# EAGLE design Calciatore Rev.2 UP (EAGLE 7.2.0)

## Sheet 1 of 3
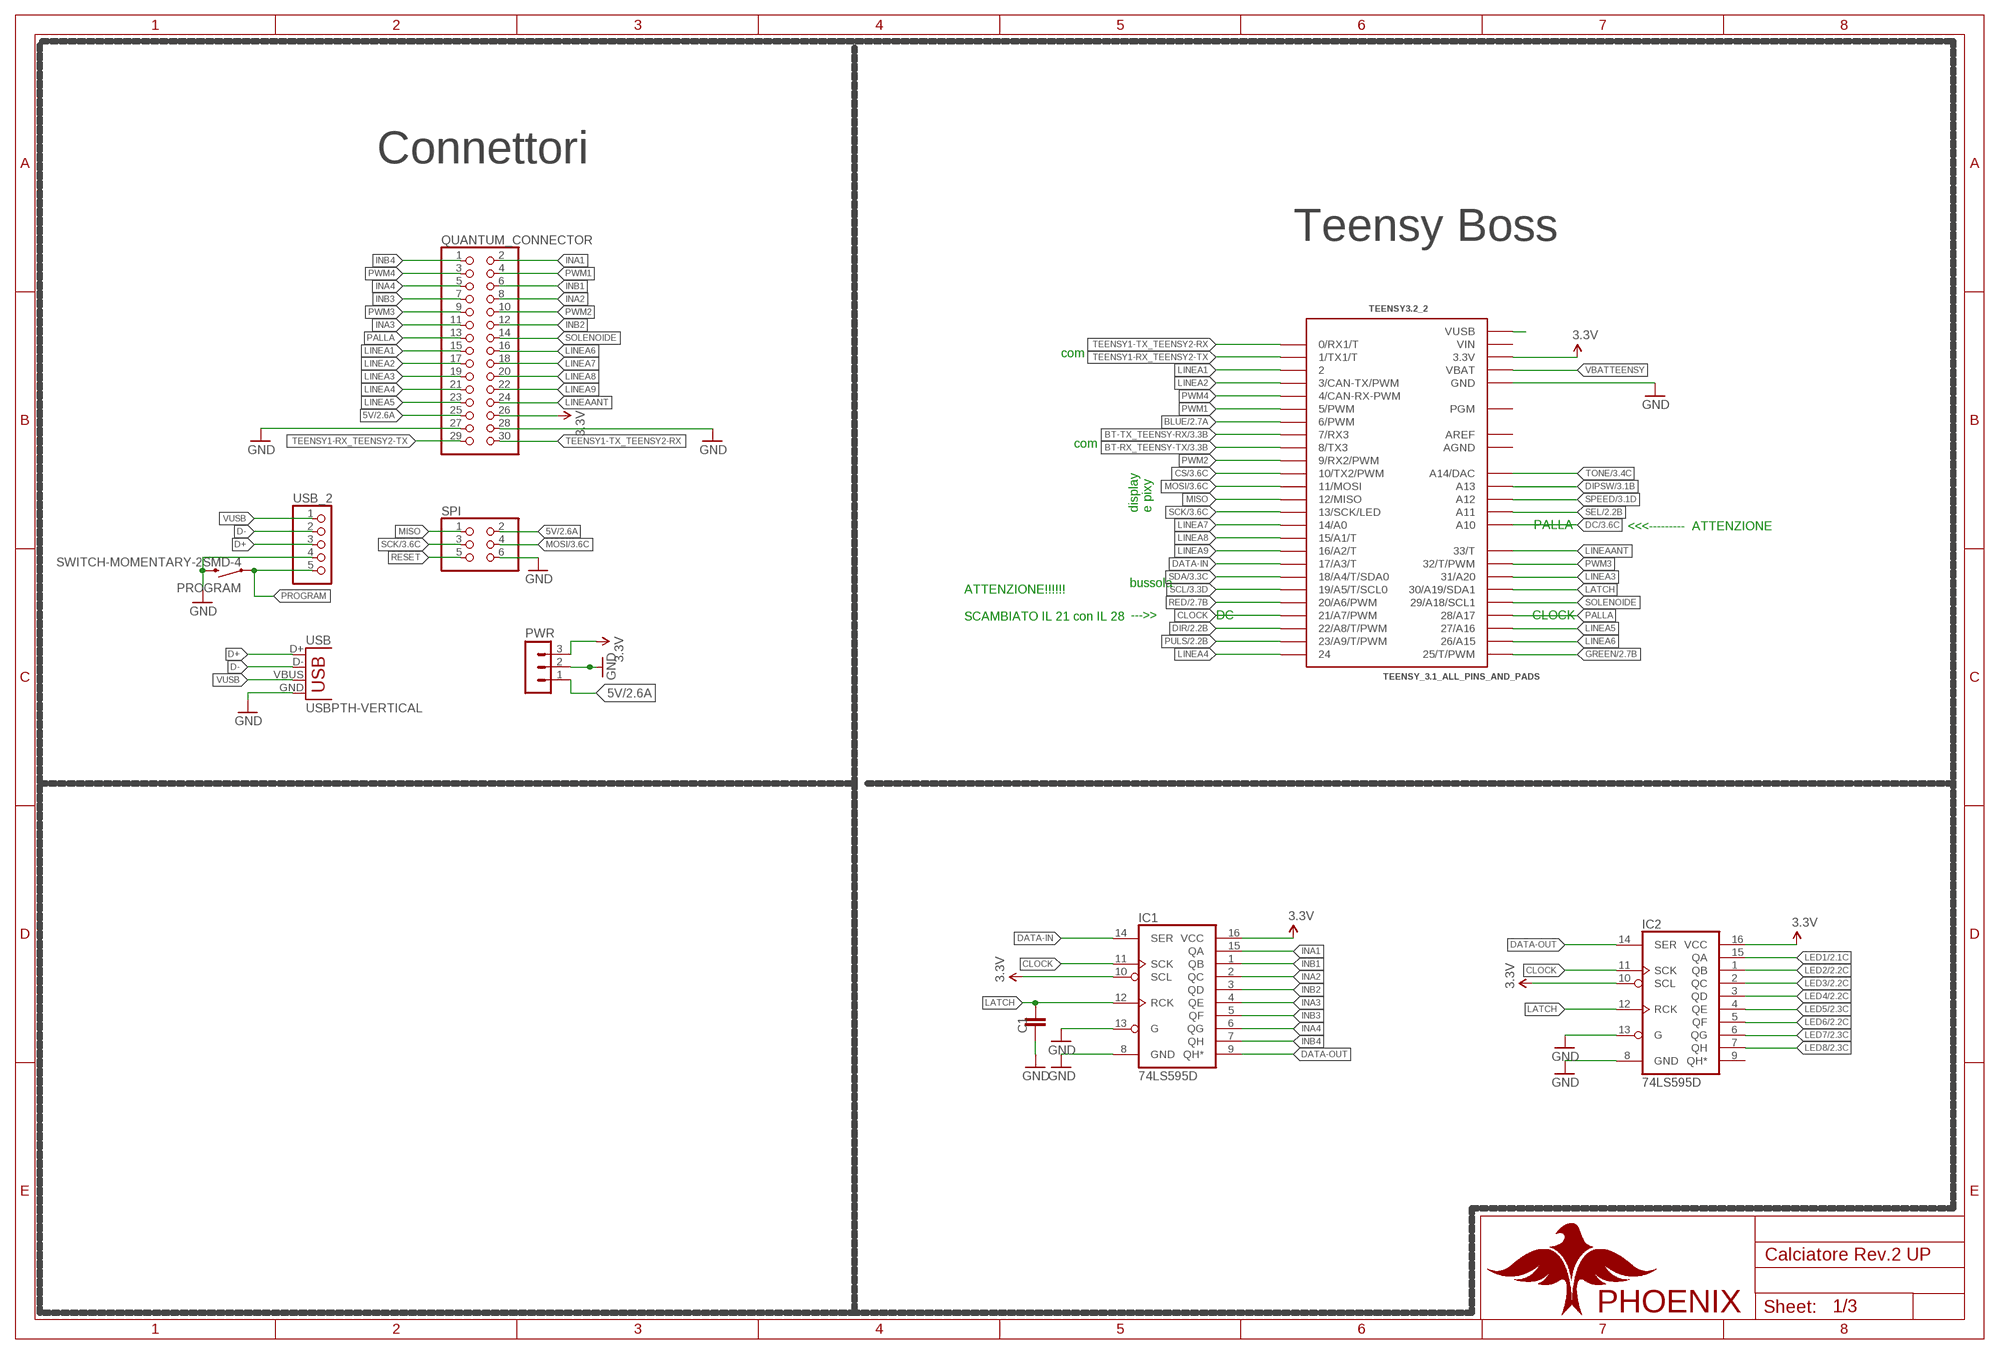
[diagram p0: schematic, sheet 1]

### Parts
C1  C-EUC1206  [C1206]
IC1  74LS595D  [SO16]
IC2  74LS595D  [SO16]
PROGRAM  SWITCH-MOMENTARY-2SMD-4  [TACTILE_SWITCH_TALL]
PWR  MA03-1  [MA03-1]
QUANTUM_CONNECTOR  PINHD-2X15  [2X15]
SPI  PINHD-2X3  [2X03]
TEENSY3.2_2  TEENSY_3.1_ALL_PINS_AND_PADS  [TEENSY3_ALL_PINS_&_PADS]
USB  USBPTH-VERTICAL  [USB-B-PTH-VERTICAL]
USB_2  PINHD-1X5  [1X05]

### Nets
3.3V [power]: IC1.10(SCL) IC1.16(VCC) IC2.10(SCL) IC2.16(VCC) PWR.3 QUANTUM_CONNECTOR.26 TEENSY3.2_2.3.3V TEENSY3.2_2.3.3V1(3.3V) TEENSY3.2_2.3.3V2(3.3V) ; also sheet 2,3
5V [power]: PWR.1 QUANTUM_CONNECTOR.25 SPI.2 ; also sheet 2
BLUE: TEENSY3.2_2.6(6/PWM) ; also sheet 2
BT-RX_TEENSY-TX: TEENSY3.2_2.8(8/TX3) ; also sheet 3
BT-TX_TEENSY-RX: TEENSY3.2_2.7(7/RX3) ; also sheet 3
CLOCK: IC1.11(SCK) IC2.11(SCK) TEENSY3.2_2.21/A7(21/A7/PWM)
CS: TEENSY3.2_2.10(10/TX2/PWM) ; also sheet 3
D+: USB.D+ USB_2.3
D-: USB.D- USB_2.2
DATA-IN: IC1.14(SER) TEENSY3.2_2.17/A3(17/A3/T)
DATA-OUT: IC1.9(QH*) IC2.14(SER)
DC: TEENSY3.2_2.A10 ; also sheet 3
DIPSW: TEENSY3.2_2.A13 ; also sheet 3
DIR: TEENSY3.2_2.22/A8(22/A8/T/PWM) ; also sheet 2
GND [gnd]: C1.1 IC1.8(GND) IC1.13(G) IC2.8(GND) IC2.13(G) PROGRAM.B2 PWR.2 QUANTUM_CONNECTOR.27 QUANTUM_CONNECTOR.28 SPI.6 TEENSY3.2_2.GND TEENSY3.2_2.GND1(GND) TEENSY3.2_2.GND2(GND) USB.GND USB_2.4 ; also sheet 2,3
GREEN: TEENSY3.2_2.25(25/T/PWM) ; also sheet 2
INA1: IC1.15(QA) QUANTUM_CONNECTOR.2
INA2: IC1.2(QC) QUANTUM_CONNECTOR.8
INA3: IC1.4(QE) QUANTUM_CONNECTOR.11
INA4: IC1.6(QG) QUANTUM_CONNECTOR.5
INB1: IC1.1(QB) QUANTUM_CONNECTOR.6
INB2: IC1.3(QD) QUANTUM_CONNECTOR.12
INB3: IC1.5(QF) QUANTUM_CONNECTOR.7
INB4: IC1.7(QH) QUANTUM_CONNECTOR.1
LATCH: C1.2 IC1.12(RCK) IC2.12(RCK) TEENSY3.2_2.30(30/A19/SDA1)
LED1: IC2.15(QA) ; also sheet 2
LED2: IC2.1(QB) ; also sheet 2
LED3: IC2.2(QC) ; also sheet 2
LED4: IC2.3(QD) ; also sheet 2
LED5: IC2.4(QE) ; also sheet 2
LED6: IC2.5(QF) ; also sheet 2
LED7: IC2.6(QG) ; also sheet 2
LED8: IC2.7(QH) ; also sheet 2
LINEA1: QUANTUM_CONNECTOR.15 TEENSY3.2_2.2
LINEA2: QUANTUM_CONNECTOR.17 TEENSY3.2_2.3(3/CAN-TX/PWM)
LINEA3: QUANTUM_CONNECTOR.19 TEENSY3.2_2.31(31/A20)
LINEA4: QUANTUM_CONNECTOR.21 TEENSY3.2_2.24
LINEA5: QUANTUM_CONNECTOR.23 TEENSY3.2_2.27(27/A16)
LINEA6: QUANTUM_CONNECTOR.16 TEENSY3.2_2.26(26/A15)
LINEA7: QUANTUM_CONNECTOR.18 TEENSY3.2_2.14/A0
LINEA8: QUANTUM_CONNECTOR.20 TEENSY3.2_2.15/A1(15/A1/T)
LINEA9: QUANTUM_CONNECTOR.22 TEENSY3.2_2.16/A2(16/A2/T)
LINEAANT: QUANTUM_CONNECTOR.24 TEENSY3.2_2.33(33/T)
MISO: SPI.1 TEENSY3.2_2.12(12/MISO)
MOSI: SPI.4 TEENSY3.2_2.11(11/MOSI) ; also sheet 3
N$4: TEENSY3.2_2.VUSB
PALLA: QUANTUM_CONNECTOR.13 TEENSY3.2_2.28(28/A17)
PROGRAM: PROGRAM.A2 USB_2.5
PULS: TEENSY3.2_2.23/A9(23/A9/T/PWM) ; also sheet 2
PWM1: QUANTUM_CONNECTOR.4 TEENSY3.2_2.5(5/PWM)
PWM2: QUANTUM_CONNECTOR.10 TEENSY3.2_2.9(9/RX2/PWM)
PWM3: QUANTUM_CONNECTOR.9 TEENSY3.2_2.32(32/T/PWM)
PWM4: QUANTUM_CONNECTOR.3 TEENSY3.2_2.4(4/CAN-RX-PWM)
RED: TEENSY3.2_2.20/A6(20/A6/PWM) ; also sheet 2
RESET: SPI.5
SCK: SPI.3 TEENSY3.2_2.13(13/SCK/LED) ; also sheet 3
SCL: TEENSY3.2_2.19/A5(19/A5/T/SCL0) ; also sheet 3
SDA: TEENSY3.2_2.18/A4(18/A4/T/SDA0) ; also sheet 3
SEL: TEENSY3.2_2.A11 ; also sheet 2
SOLENOIDE: QUANTUM_CONNECTOR.14 TEENSY3.2_2.29(29/A18/SCL1)
SPEED: TEENSY3.2_2.A12 ; also sheet 3
TEENSY1-RX_TEENSY2-TX: QUANTUM_CONNECTOR.29 TEENSY3.2_2.1(1/TX1/T)
TEENSY1-TX_TEENSY2-RX: QUANTUM_CONNECTOR.30 TEENSY3.2_2.0(0/RX1/T)
TONE: TEENSY3.2_2.RESET/DAC(A14/DAC) ; also sheet 3
VBATTEENSY: TEENSY3.2_2.VBAT
VUSB: USB.VBUS USB_2.1
Unconnected: IC2.9(QH*) TEENSY3.2_2.PGM

### Notes on the sheet
- Connettori
- Teensy Boss
- com
- com
- display
  e pixy
- PALLA | <<<---------  ATTENZIONE
- bussola
- --->> | DC | CLOCK
- ATTENZIONE!!!!!!
  
  SCAMBIATO IL 21 con IL 28
- PHOENIX

## Sheet 2 of 3
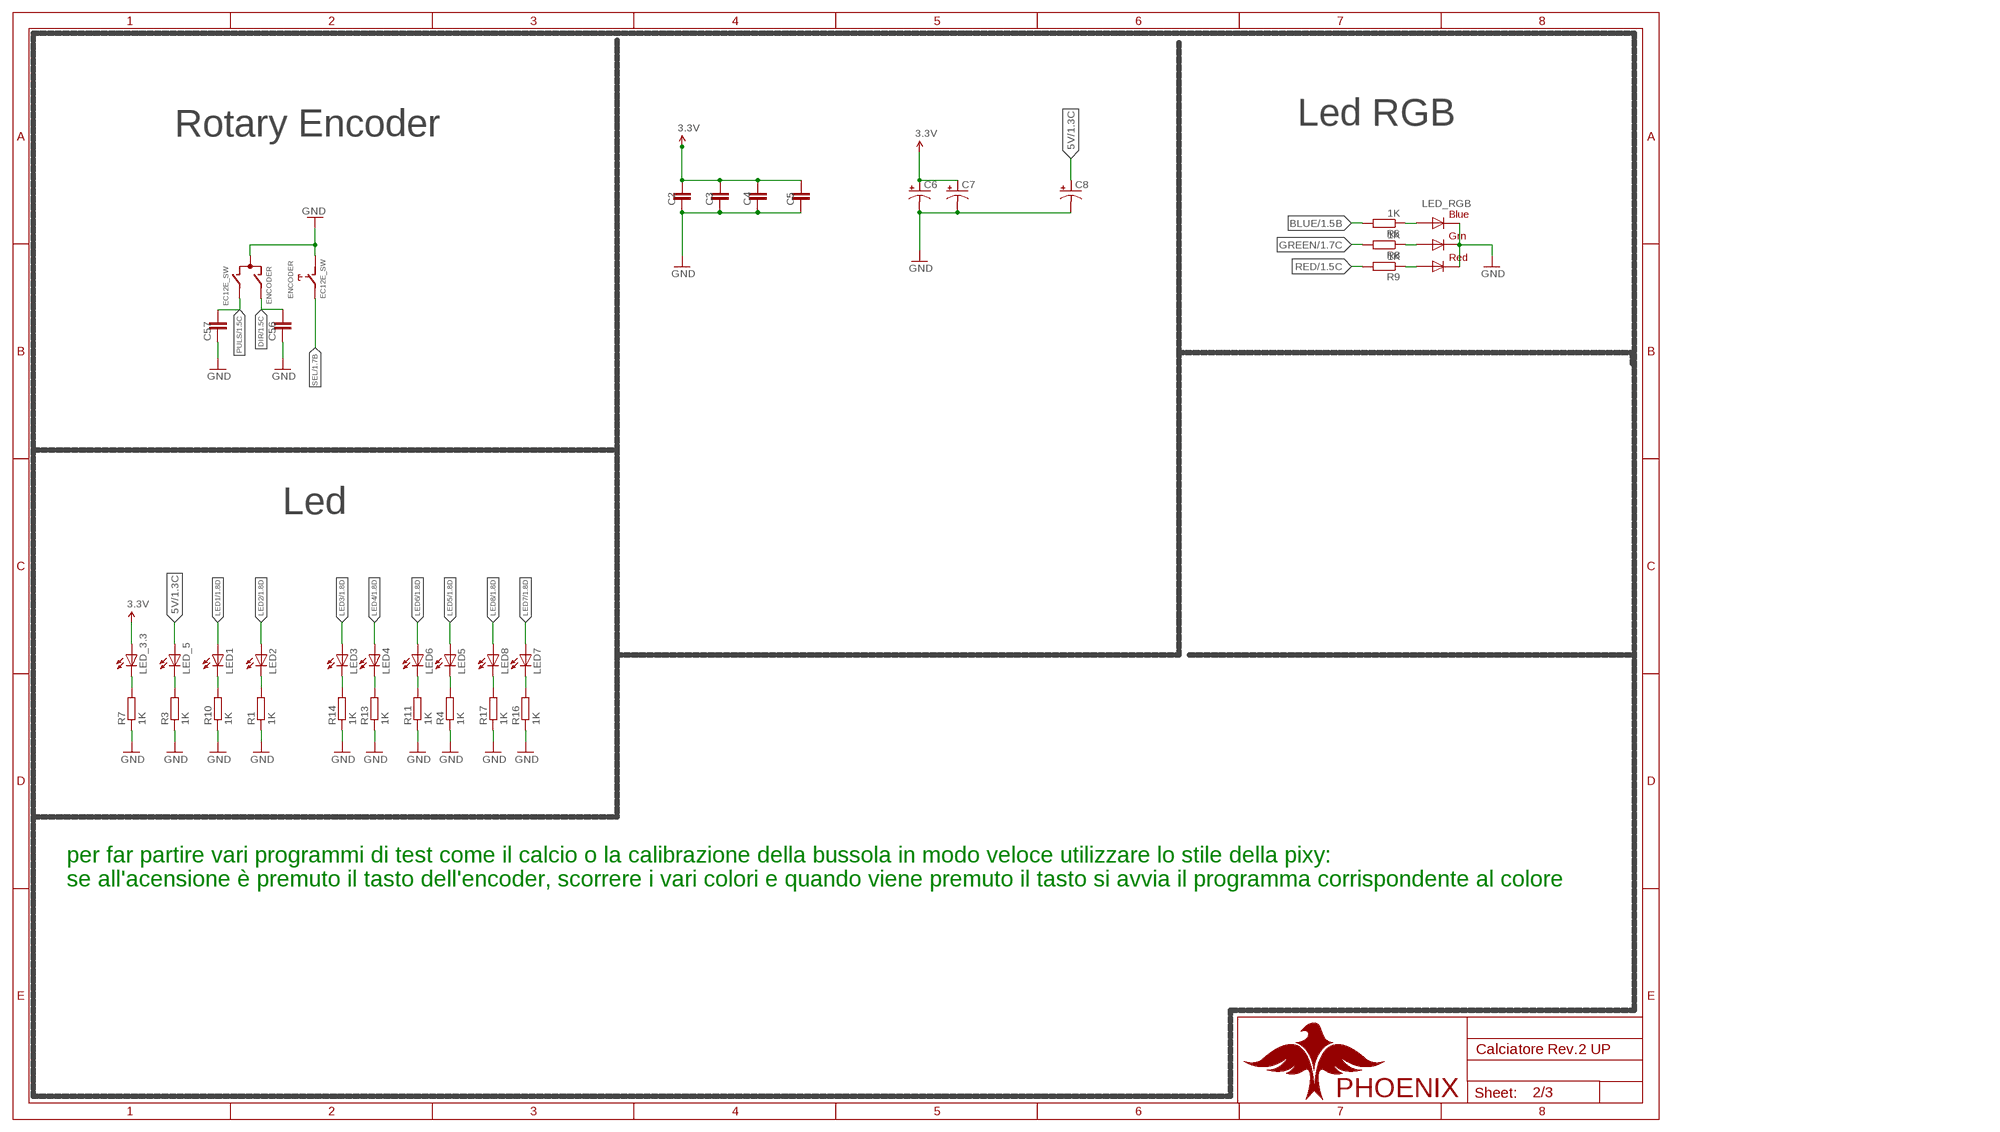
[diagram p1: schematic, sheet 2]

### Parts
C2  C-EUC1206  [C1206]
C3  C-EUC1206  [C1206]
C4  C-EUC1206  [C1206]
C5  C-EUC1206  [C1206]
C6  CPOL-USE3.5-8  [E3,5-8]
C7  CPOL-USE3.5-8  [E3,5-8]
C8  CPOL-USE3.5-8  [E3,5-8]
C56  C-EUC1206  [C1206]
C57  C-EUC1206  [C1206]
ENCODER  EC12E_SW  [ALPS_EC12E_SW]
LED1  LEDSMT1206  [1206]
LED2  LEDSMT1206  [1206]
LED3  LEDSMT1206  [1206]
LED4  LEDSMT1206  [1206]
LED5  LEDSMT1206  [1206]
LED6  LEDSMT1206  [1206]
LED7  LEDSMT1206  [1206]
LED8  LEDSMT1206  [1206]
LED_3.3  LEDSMT1206  [1206]
LED_5  LEDSMT1206  [1206]
LED_RGB  RGBLED5050  [RGBLED5050]
R1  1K  R-EU_M1206  [M1206]
R3  1K  R-EU_M1206  [M1206]
R4  1K  R-EU_M1206  [M1206]
R5  1K  R-EU_M1206  [M1206]
R7  1K  R-EU_M1206  [M1206]
R8  1K  R-EU_M1206  [M1206]
R9  1K  R-EU_M1206  [M1206]
R10  1K  R-EU_M1206  [M1206]
R11  1K  R-EU_M1206  [M1206]
R13  1K  R-EU_M1206  [M1206]
R14  1K  R-EU_M1206  [M1206]
R16  1K  R-EU_M1206  [M1206]
R17  1K  R-EU_M1206  [M1206]

### Nets
3.3V [power]: C2.2 C3.2 C4.2 C5.2 C6.+ C7.+ LED_3.3.A ; also sheet 1,3
5V [power]: C8.+ LED_5.A ; also sheet 1
BLUE: R5.2 ; also sheet 1
DIR: C56.2 ENCODER.A ; also sheet 1
GND [gnd]: C2.1 C3.1 C4.1 C5.1 C6.- C7.- C8.- C56.1 C57.1 ENCODER.C ENCODER.D LED_RGB.4(BLUE_C) LED_RGB.5(RED_C) LED_RGB.6(GREEN_C) R1.1 R3.1 R4.1 R7.1 R10.1 R11.1 R13.1 R14.1 R16.1 R17.1 ; also sheet 1,3
GREEN: R8.2 ; also sheet 1
LED1: LED1.A ; also sheet 1
LED2: LED2.A ; also sheet 1
LED3: LED3.A ; also sheet 1
LED4: LED4.A ; also sheet 1
LED5: LED5.A ; also sheet 1
LED6: LED6.A ; also sheet 1
LED7: LED7.A ; also sheet 1
LED8: LED8.A ; also sheet 1
LED_3.3: LED_3.3.C R7.2
N$1: LED2.C R1.2
N$2: LED_5.C R3.2
N$3: LED5.C R4.2
N$5: LED6.C R11.2
N$6: LED7.C R16.2
N$8: LED_RGB.3(BLUE_A) R5.1
N$10: LED_RGB.1(GREEN_A) R8.1
N$11: LED_RGB.2(RED_A) R9.1
N$12: LED1.C R10.2
N$13: LED4.C R13.2
N$14: LED3.C R14.2
N$16: LED8.C R17.2
PULS: C57.2 ENCODER.B ; also sheet 1
RED: R9.2 ; also sheet 1
SEL: ENCODER.E ; also sheet 1
Unconnected: ENCODER.GND1(G) ENCODER.GND2(G)

### Notes on the sheet
- Rotary Encoder | Led RGB
- Led
- per far partire vari programmi di test come il calcio o la calibrazione della bussola in modo veloce utilizzare lo stile della pixy:
  se all'acensione è premuto il tasto dell'encoder, scorrere i vari colori e quando viene premuto il tasto si avvia il programma corrispondente al colore
- PHOENIX

## Sheet 3 of 3
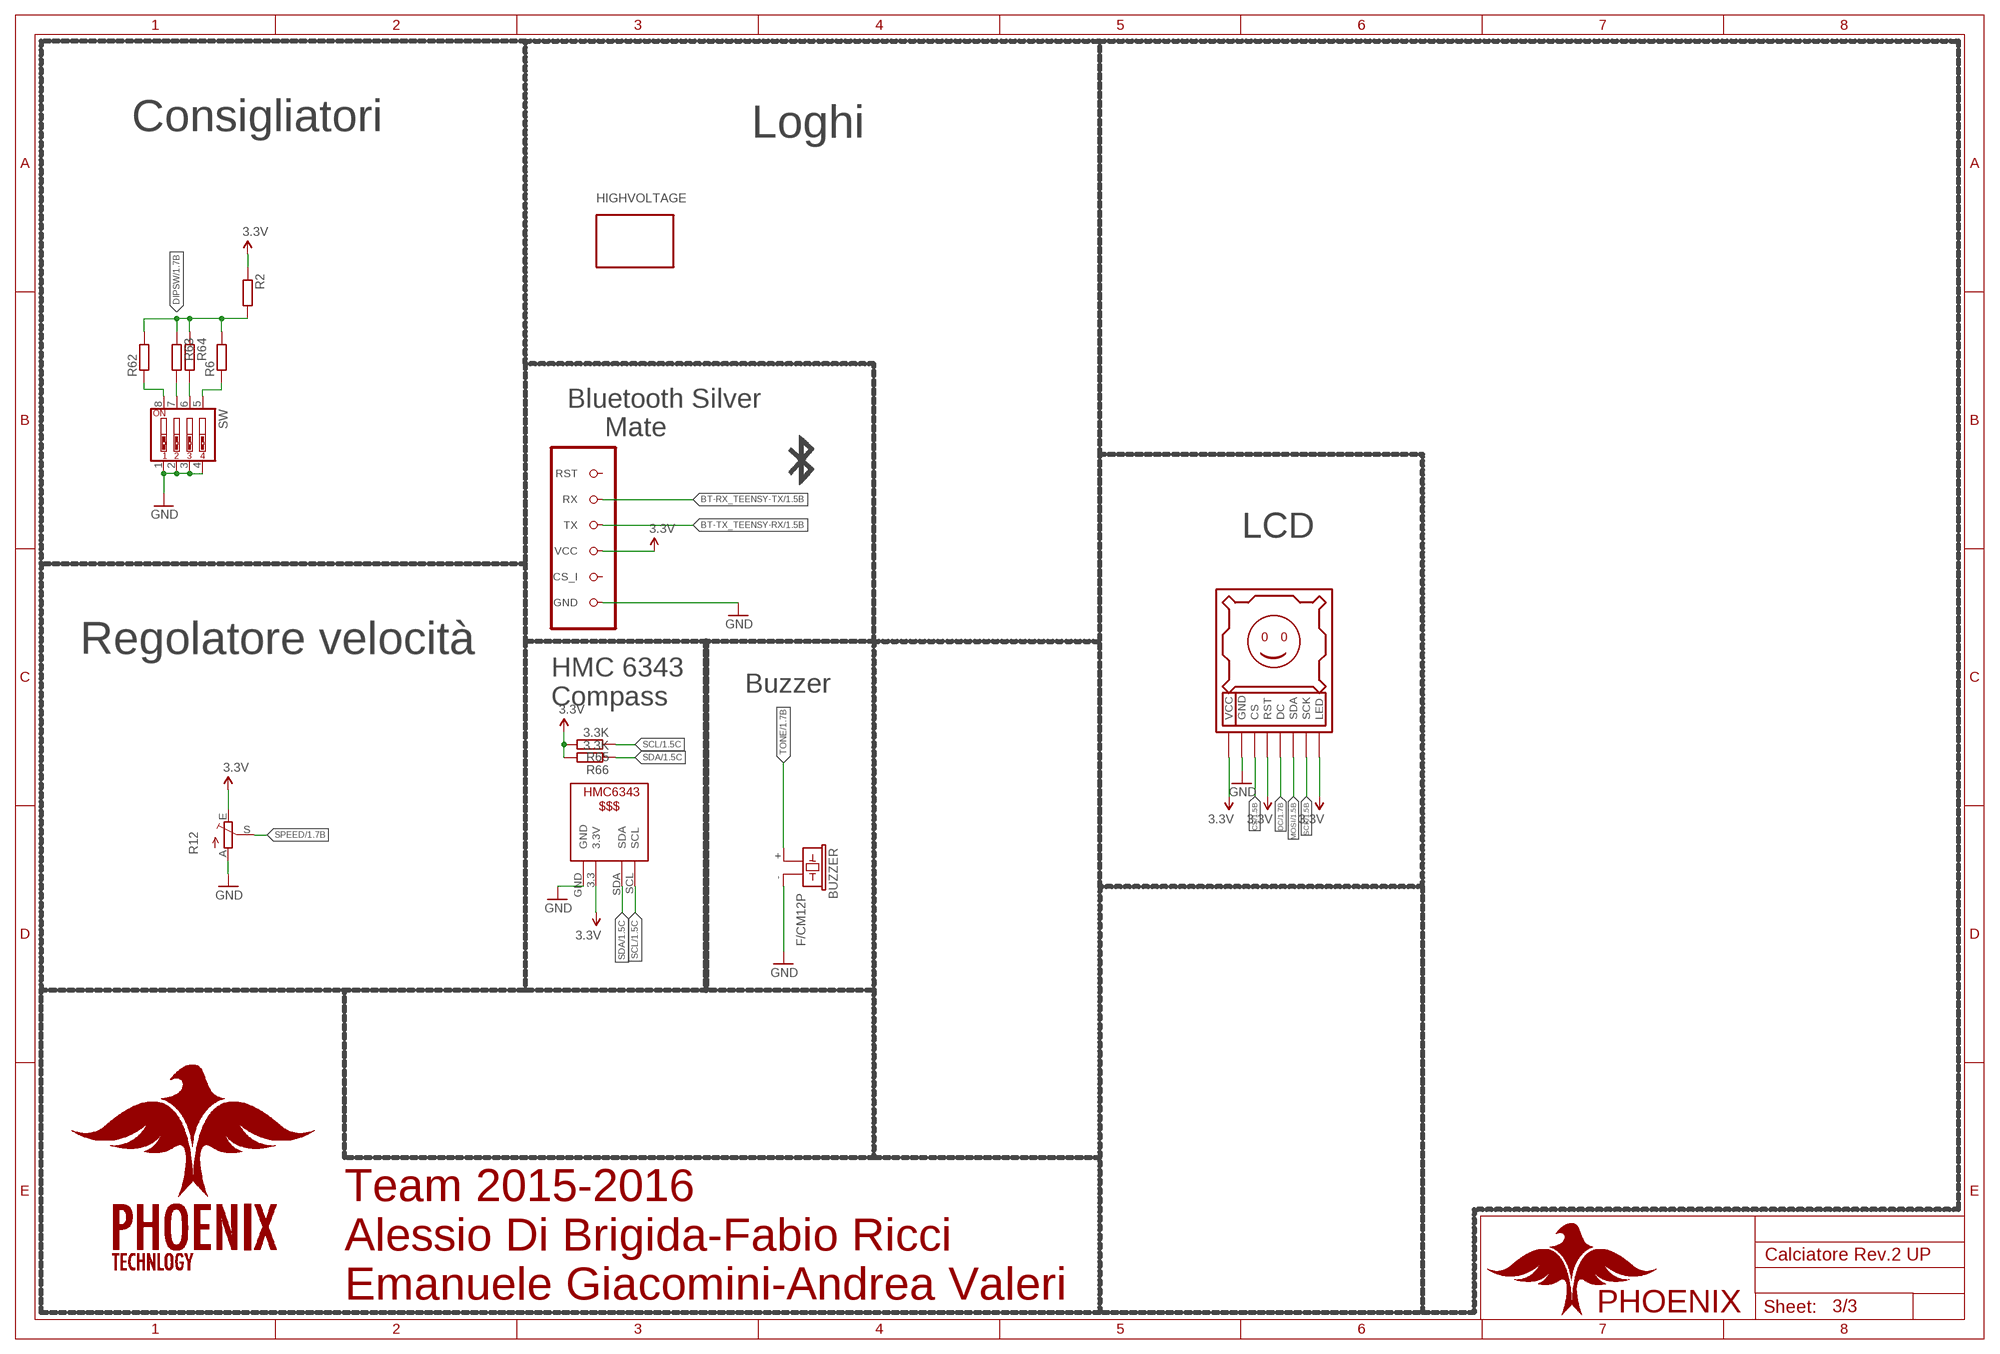
[diagram p2: schematic, sheet 3]

### Parts
BUZZER  F/CM12P  [F/CM12P]
DISPLAY1  DISPLAY128X128  [DISPLAY128X128]
HIGHVOLTAGE  LOGO  [LOGOHV]
R2  10K  R-EU_M1206  [M1206]
R6  10K  R-EU_M1206  [M1206]
R12  TRIM_EU-S63P  [S63P]
R62  10K  R-EU_M1206  [M1206]
R63  10K  R-EU_M1206  [M1206]
R64  10K  R-EU_M1206  [M1206]
R65  3.3K  R-EU_M1206  [M1206]
R66  3.3K  R-EU_M1206  [M1206]
SW  SW_DIP-4  [EDG-04]
U$5  HMC6343  [HMC6343]
U$9  BLUETOOTH  [BLUETOOTH]

### Nets
3.3V [power]: DISPLAY1.LED DISPLAY1.RST DISPLAY1.VCC R2.1 R12.E R65.2 R66.2 U$5.3.3(3.3V) U$9.VCC ; also sheet 1,2
BT-RX_TEENSY-TX: U$9.RX ; also sheet 1
BT-TX_TEENSY-RX: U$9.TX ; also sheet 1
CS: DISPLAY1.CS ; also sheet 1
DC: DISPLAY1.DC ; also sheet 1
DIPSW: R2.2 R6.2 R62.2 R63.1 R64.1 ; also sheet 1
GND [gnd]: BUZZER.- DISPLAY1.GND R12.A SW.1 SW.2 SW.3 SW.4 U$5.GND U$9.GND ; also sheet 1,2
MOSI: DISPLAY1.SDA ; also sheet 1
N$18: R64.2 SW.6
N$20: R62.1 SW.8
N$96: R6.1 SW.5
N$97: R63.2 SW.7
SCK: DISPLAY1.SCK ; also sheet 1
SCL: R65.1 U$5.SCL ; also sheet 1
SDA: R66.1 U$5.SDA ; also sheet 1
SPEED: R12.S ; also sheet 1
TONE: BUZZER.+ ; also sheet 1
Unconnected: U$9.CS_I U$9.RST

### Notes on the sheet
- Consigliatori | Loghi
- Bluetooth Silver
       Mate
- LCD
- Regolatore velocità
- Buzzer
- HMC 6343
  Compass
- Team 2015-2016
  Alessio Di Brigida-Fabio Ricci
  Emanuele Giacomini-Andrea Valeri
- PHOENIX

## Power pins joined to a net without a drawn wire
AGND: TEENSY3.2_2.AGND
AREF: TEENSY3.2_2.AREF
VIN: TEENSY3.2_2.VIN

## Library data of the parts
BUZZER = buzzer:F/CM12P: BUZZER Source: Buerklin; OC_FARNELL: unknown; OC_NEWARK: unknown
C1-C5 C56 C57 = rcl:C-EU: CAPACITOR, European symbol
C6-C8 = adafruit:CPOL-US: POLARIZED CAPACITOR, American symbol
DISPLAY1 = Display 128x128:DISPLAY128X128: LCD 1.44" Red Serial 128X128 SPI Color TFT LCD Display Module for Nokia 15XX Product information Description： 100% brand new and high quality 1.44-inch screen with SPI serial backplane module, a minimum of only four IO-driven resolution 128 * 128 Spike NOKIA 15XX, perfect upgrade true color Size: 1.44 inch SPI serial bus Resolution 128 * 128 Package Include:
ENCODER = switch-alps:EC12E_SW: ALPS rotary Encoder EC12E series with switch; MPN: EC12E2424407; OC_FARNELL: 1520813; OC_NEWARK: 74M1068
HIGHVOLTAGE = Loghi:LOGO
IC1 IC2 = SparkFun-DigitalIC:74*595: 8-bit SHIFT REGISTER, output latch; PROD_ID: IC-07875
LED1-LED8 LED_3.3 LED_5 = adafruit:LED: LED OSRAM: - CHIPLED LG R971, LG N971, LY N971, LG Q971, LY Q971, LO R971, LY R971 LH N974, LH R974 LS Q976, LO Q976, LY Q976 LO Q996 - Hyper CHIPLED LW Q18S LB Q993, LB Q99A, LB R99A - SideLED LS A670, LO A670, LY A670, LG A670, LP A670 LB A673, LV A673, LT A673, LW A673 LH A674 LY A675 LS A676, LA A676, LO A676, LY A676, LW A676 LS A679, LY A679, LG A679 - Hyper Micro SIDELED® LS Y876, LA Y876, LO Y876, LY Y876 LT Y87S - SmartLED LW L88C, LW L88S LB L89C, LB L89S, LG L890 LS L89K, LO L89K, LY L89K LS L896, LA L896, LO L896, LY L896 - TOPLED LS T670, LO T670, LY T670, LG T670, LP T670 LSG T670, LSP T670, LSY T670, LOP T670, LYG T670 LG T671, LOG T671, LSG T671 LB T673, LV T673, LT T673, LW T673 LH T674 LS T676, LA T676, LO T676, LY T676, LB T676, LH T676, LSB T676, LW T676 LB T67C, LV T67C, LT T67C, LS T67K, LO T67K, LY T67K, LW E67C LS E67B, LA E67B, LO E67B, LY E67B, LB E67C, LV E67C, LT E67C LW T67C LS T679, LY T679, LG T679 LS T770, LO T770, LY T770, LG T770, LP T770 LB T773, LV T773, LT T773, LW T773 LH T774 LS E675, LA E675, LY E675, LS T675 LS T776, LA T776, LO T776, LY T776, LB T776 LHGB T686 LT T68C, LB T68C - Hyper Mini TOPLED® LB M676 - Mini TOPLED Santana® LG M470 LS M47K, LO M47K, LY M47K Source: http://www.osram.convergy.de/
LED_RGB = adafruit:RGBLED: For 5050 RGB LEDs, the order of the LEDs may vary from one manufacturer to another!
PROGRAM = SparkFun-Electromechanical:SWITCH-MOMENTARY-2: Various NO switches- pushbuttons, reed, etc; PROD_ID: SWCH-11966
PWR = con-lstb:MA03-1: PIN HEADER; OC_FARNELL: unknown; OC_NEWARK: unknown
QUANTUM_CONNECTOR = pinhead:PINHD-2X15: PIN HEADER
R1 R3-R5 R7-R11 R13 R14 R16 R17 = resistor:R-EU_: RESISTOR, European symbol
R2 R6 R62-R66 = rcl:R-EU_: RESISTOR, European symbol
R12 = pot:TRIM_EU-: POTENTIOMETER
SPI = pinhead:PINHD-2X3: PIN HEADER
SW = special:SW_DIP-4: DIP SWITCH
TEENSY3.2_2 = Teensy_3_and_LC_Series_Boards_v1.1:TEENSY_3.1_ALL_PINS_AND_PADS: Footprint for Teensy 3.1 or 3.2 board using all pads and all through-holes. Pads need a 2x7 0.1" SMD header.
U$5 = HMC6343:HMC6343
U$9 = Bluetooth:BLUETOOTH
USB = SparkFun-Connectors:USB: USB Connectors USB-B-PTH is fully proven SKU : PRT-00139/CONN-08278 USB-miniB is fully proven SKU : PRT-00587 USB-A-PCB is untested. USB-A-H is throughly reviewed, but untested. Spark Fun Electronics SKU : PRT-00437 USB-B-SMT is throughly reviewed, but untested. Needs silkscreen touching up. USB-A-S has not been used/tested USB-MB-H has not been used/tested USB-MICROB has been used. CONN-09505
USB_2 = pinhead:PINHD-1X5: PIN HEADER

## Net classes
0 default: width 0.254 mm, drill 0.254 mm, clearance 0.203 mm
1 power: width 1.016 mm, drill 0.889 mm, clearance 0.508 mm
2 gnd: width 0.864 mm, drill 0.406 mm, clearance 0.381 mm
3 power usb: width 0.305 mm, drill 0.406 mm, clearance 0.203 mm

## Board
Robot Calciatore SMD V2 Costruttori: Fabio Ricci Alessio Di Brigida
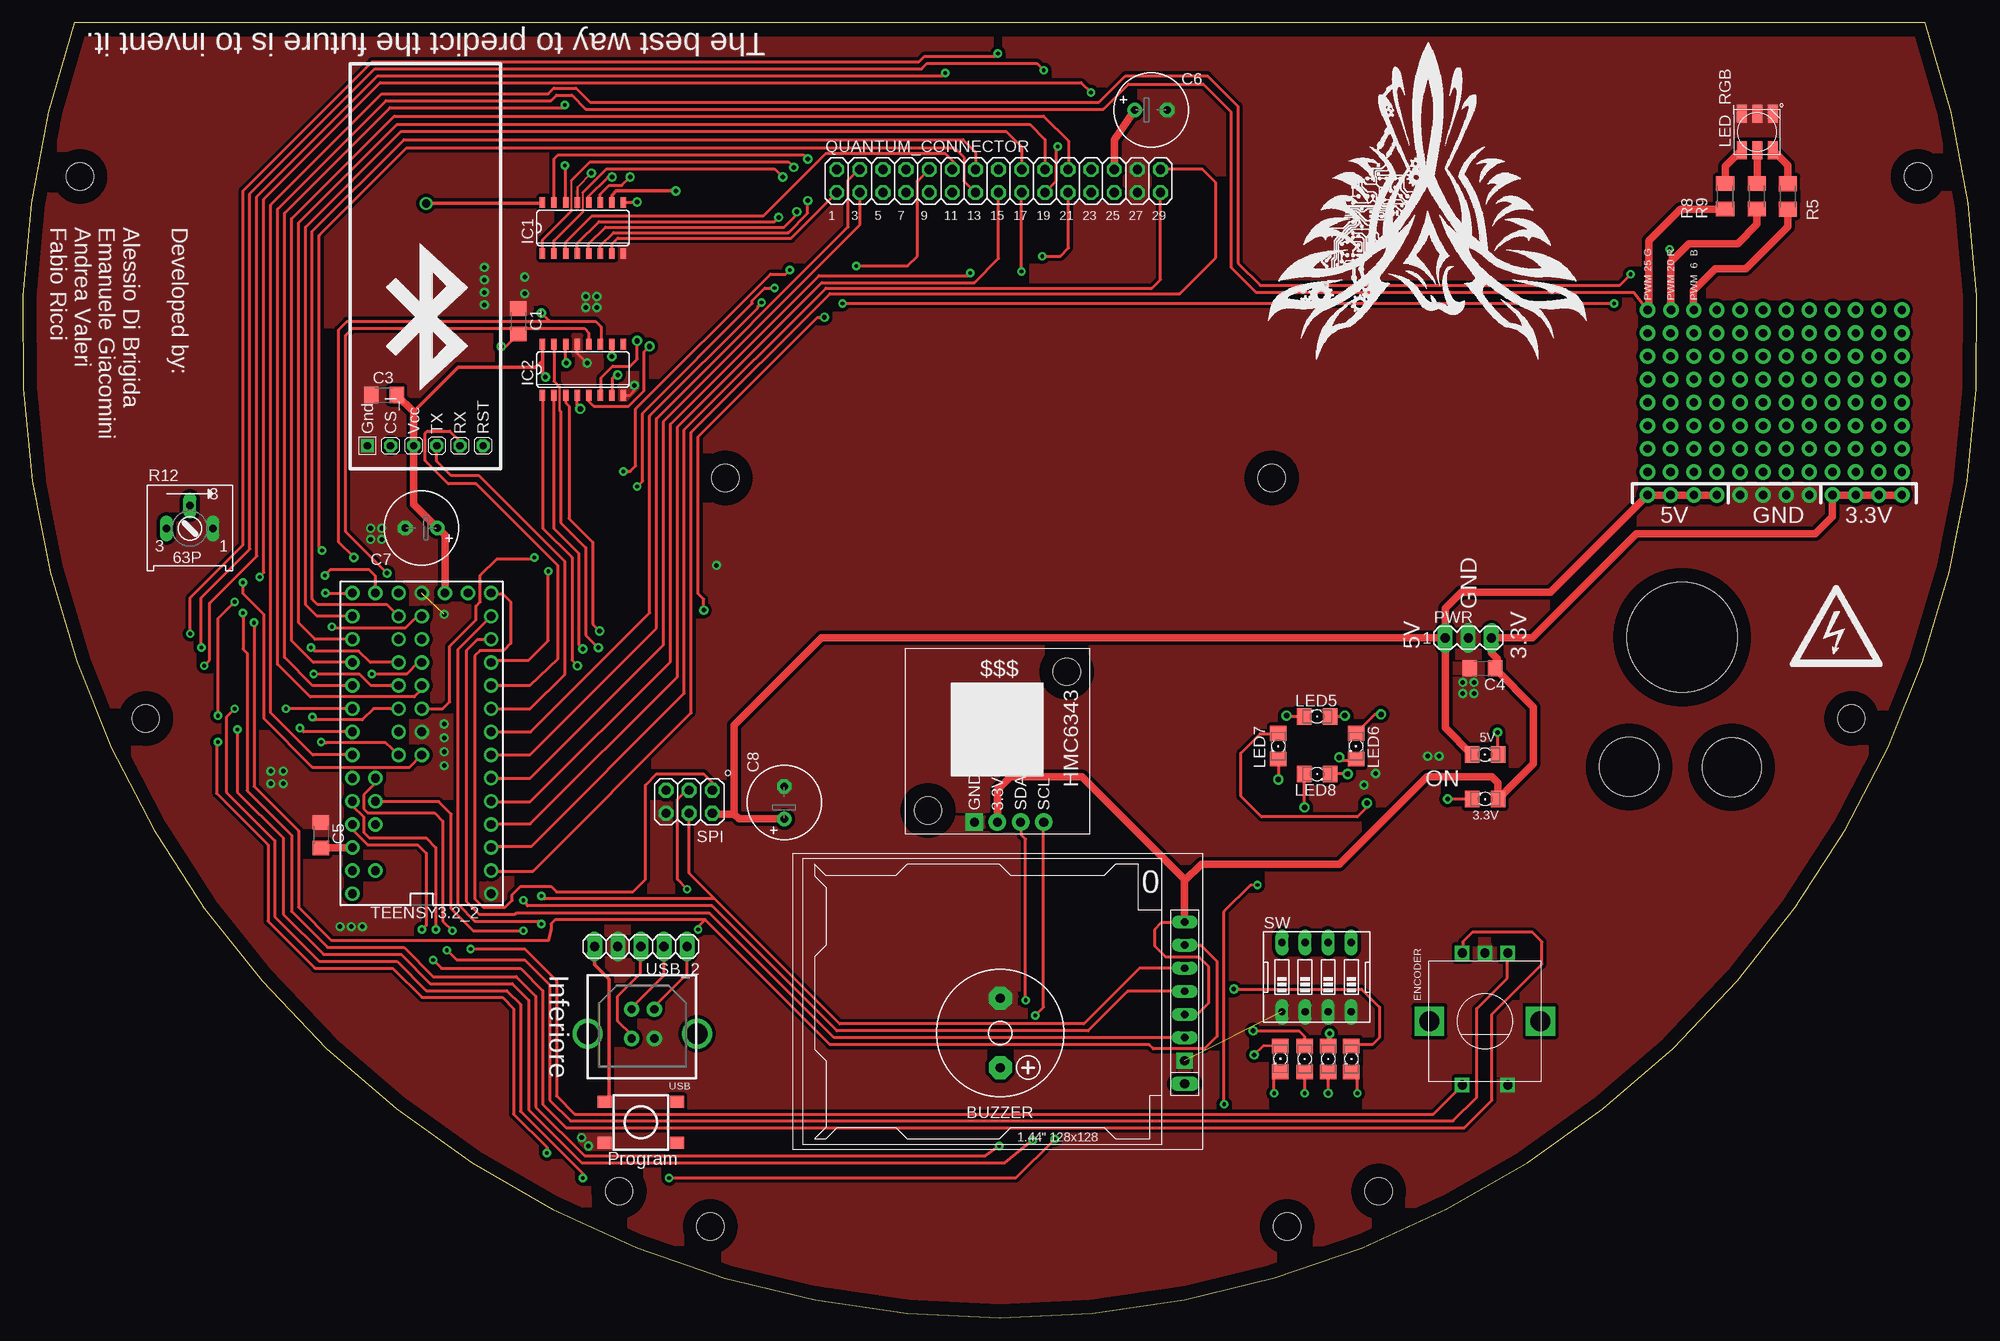
[diagram p3: board, top side]
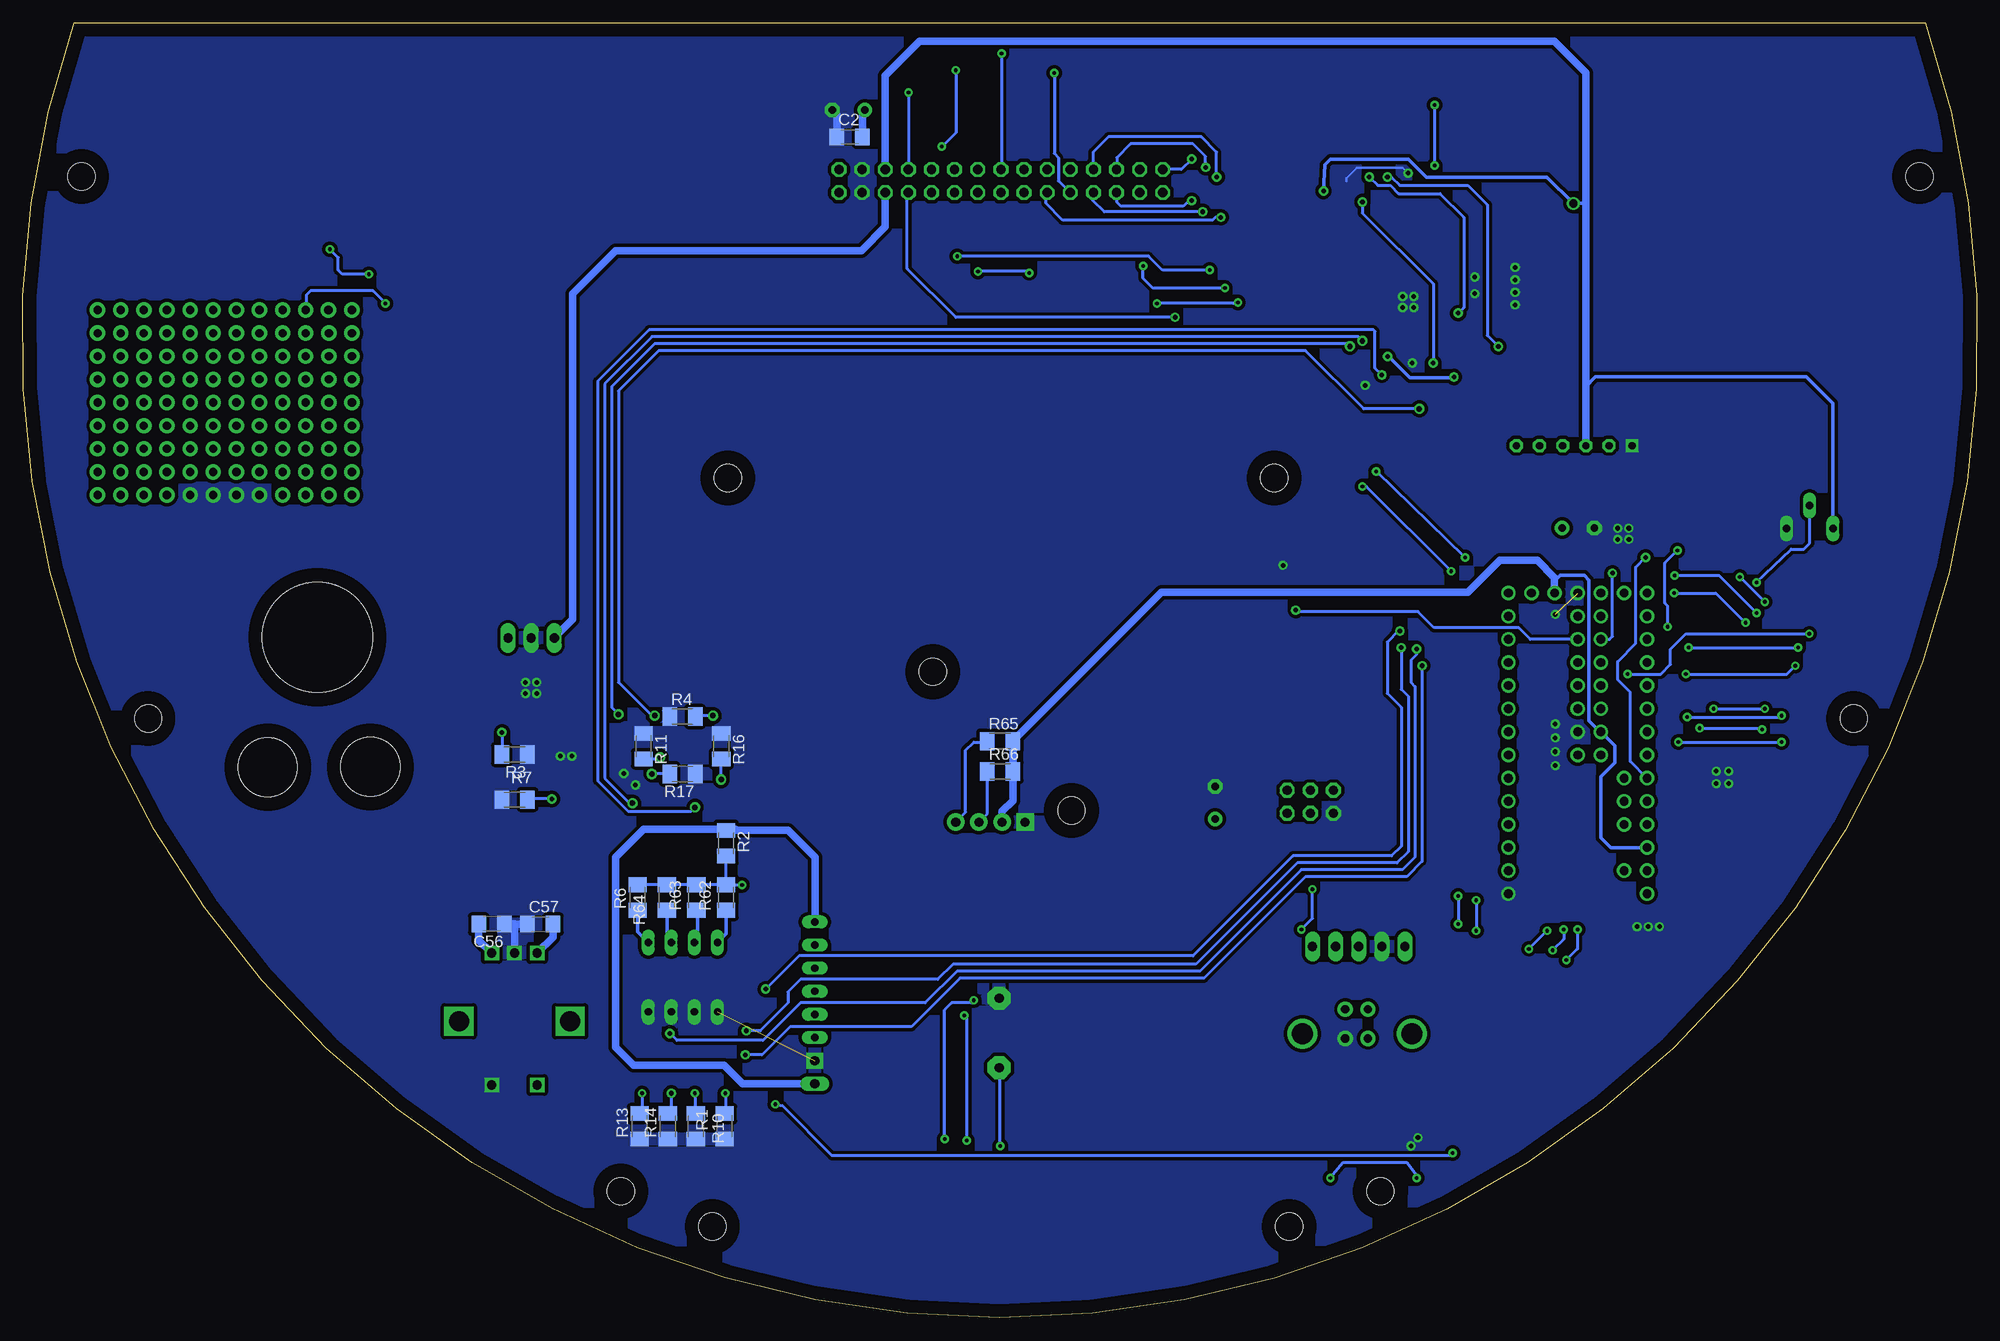
[diagram p4: board, bottom side, seen from below]

Size 214.58 x 142.18 mm. Coordinates in mm from the lower left corner, seen from the top.
Outline: 107.29,0.02 arc109 208.94,142.18 5.64,142.18 arc109 107.29,0
Copper layers (1*16): Top 0.035mm / dielectric 1.5mm / Bottom 0.035mm
Design rules "SparkFun *": minimum track width 6mil, minimum drill 8mil, track to track 6mil, track to pad 6mil, pad to pad 6mil, via to via 6mil, smd to smd 6mil, copper to edge 1.5mm, drill to drill 6mil, minimum pad ring 12mil, minimum via ring 10mil, stop-mask expansion 4mil, vias tented up to drill 25mil, thermal gap 0mil
Holes 3 mm at 13.52,65.8 6.28,125.31 77.14,92.19 137.16,92.19 208.13,125.31 200.82,65.8 148.9,13.88 138.86,10.02 75.52,10.02 65.48,13.88
Holes 6.5 mm at 176.41,60.49 187.68,60.44
Holes 12.1 mm at 182.22,74.72

### Footprints (pad centres in the part's own frame; a part is rotated, then mirrored left to right if it is on the bottom)
F/CM12P = drill 1.016 pad 2.54 octagon: + 3.81,0; - -3.81,0
C1206 = smd 1.6 x 1.8: 1 -1.4,0; 2 1.4,0
E3,5-8 = drill 0.813 pad 1.6: + -1.778,0 | drill 0.813 pad 1.6 octagon: - 1.778,0
DISPLAY128X128 = drill 0.8 long: CS 20.32,-5.08; DC 20.32,0; LED 20.32,7.62; RST 20.32,-2.54; SCK 20.32,5.08; SDA 20.32,2.54 | drill 1 pad 1.778 square: GND 20.32,-7.62 | drill 1 long: VCC 20.32,-10.16
ALPS_EC12E_SW = drill 1 square: A -2.5,-7.5; B 2.5,-7.5; C 0,-7.5; D -2.5,7; E 2.5,7 | drill 2.2 square: GND1 -6.1,0; GND2 6.1,0
SO16 = smd 0.6 x 1.2: 1 -4.445,-2.8; 2 -3.175,-2.8; 3 -1.905,-2.8; 4 -0.635,-2.8; 5 0.635,-2.8; 6 1.905,-2.8; 7 3.175,-2.8; 8 4.445,-2.8; 9 4.445,2.8; 10 3.175,2.8; 11 1.905,2.8; 12 0.635,2.8; 13 -0.635,2.8; 14 -1.905,2.8; 15 -3.175,2.8; 16 -4.445,2.8
1206 = smd 1.6 x 1.803: A -1.422,0; C 1.422,0
RGBLED5050 = smd 2 x 1.1: 1 -2,1.7; 2 -2,0; 3 -2,-1.7; 4 2,-1.7; 5 2,0; 6 2,1.7
TACTILE_SWITCH_TALL = smd 1.55 x 1.3: A1 -3.975,-2.25; A2 3.975,-2.25; B1 -3.975,2.25; B2 3.975,2.25
MA03-1 = drill 1.016 long: 1 -2.54,0; 2 0,0; 3 2.54,0
2X15 = drill 1.016 octagon: 1 -17.78,-1.27; 2 -17.78,1.27; 3 -15.24,-1.27; 4 -15.24,1.27; 5 -12.7,-1.27; 6 -12.7,1.27; 7 -10.16,-1.27; 8 -10.16,1.27; 9 -7.62,-1.27; 10 -7.62,1.27; 11 -5.08,-1.27; 12 -5.08,1.27; 13 -2.54,-1.27; 14 -2.54,1.27; 15 0,-1.27; 16 0,1.27; 17 2.54,-1.27; 18 2.54,1.27; 19 5.08,-1.27; 20 5.08,1.27; 21 7.62,-1.27; 22 7.62,1.27; 23 10.16,-1.27; 24 10.16,1.27; 25 12.7,-1.27; 26 12.7,1.27; 27 15.24,-1.27; 28 15.24,1.27; 29 17.78,-1.27; 30 17.78,1.27
M1206 = smd 1.6 x 2: 1 -1.4,0; 2 1.4,0
S63P = drill 0.813 long: A 2.54,0; E -2.54,0; S 0,2.54
2X03 = drill 1.016 octagon: 1 -2.54,-1.27; 2 -2.54,1.27; 3 0,-1.27; 4 0,1.27; 5 2.54,-1.27; 6 2.54,1.27
EDG-04 = drill 0.813 long: 1 -3.81,-3.81; 2 -1.27,-3.81; 3 1.27,-3.81; 4 3.81,-3.81; 5 3.81,3.81; 6 1.27,3.81; 7 -1.27,3.81; 8 -3.81,3.81
TEENSY3_ALL_PINS_&_PADS = drill 0.965: 0 -7.62,13.97; 1 -7.62,11.43; 2 -7.62,8.89; 3 -7.62,6.35; 3.3V 7.62,11.43; 3.3V1 -2.54,-16.51; 3.3V2 2.54,-1.27; 4 -7.62,3.81; 5 -7.62,1.27; 6 -7.62,-1.27; 7 -7.62,-3.81; 8 -7.62,-6.35; 9 -7.62,-8.89; 10 -7.62,-11.43; 11 -7.62,-13.97; 12 -7.62,-16.51; 13 7.62,-16.51; 14/A0 7.62,-13.97; 15/A1 7.62,-11.43; 16/A2 7.62,-8.89; 17/A3 7.62,-6.35; 18/A4 7.62,-3.81; 19/A5 7.62,-1.27; 20/A6 7.62,1.27; 21/A7 7.62,3.81; 22/A8 7.62,6.35; 23/A9 7.62,8.89; 24 0,-3.81; 25 0,-6.35; 26 0,-8.89; 27 0,-11.43; 28 0,-13.97; 29 2.54,-13.97; 30 2.54,-11.43; 31 2.54,-8.89; 32 2.54,-6.35; 33 2.54,-3.81; A10 5.08,6.35; A11 5.08,3.81; A12 0,1.27; A13 2.54,1.27; AGND 7.62,13.97; AREF 5.08,8.89; GND -7.62,16.51; GND1 0,-16.51; GND2 0,-1.27; PGM 2.54,-16.51; RESET/DAC 5.08,-16.51; VBAT -5.08,-16.51; VIN 7.62,16.51; VUSB 5.08,13.97
HMC6343 = drill 1 pad 1.93: 3.3 10.16,1.27; SCL 15.24,1.27; SDA 12.7,1.27 | drill 1 pad 1.93 square: GND 7.62,1.27 | hole 3: 2.54,2.54; 17.78,17.78
BLUETOOTH = drill 0.8 pad 1.422 octagon: CS_I -3.81,-5.08; RST 6.35,-5.08; RX 3.81,-5.08; TX 1.27,-5.08; VCC -1.27,-5.08 | drill 0.8 pad 1.422 square: GND -6.35,-5.08
USB-B-PTH-VERTICAL = drill 0.914 pad 1.676: D+ 4.826,4.394; D- 4.826,7.595; GND 7.315,4.394; VBUS 7.315,7.595 | drill 2.286: P$1 0,4.902; P$2 12.04,4.902
1X05 = drill 1.016 long: 1 -5.08,0; 2 -2.54,0; 3 0,0; 4 2.54,0; 5 5.08,0

### Placement (x,y rotation side)
BUZZER  107.36,31.27 270 top
C1  54.44,109.41 270 top
C2  123.78,129.66 0 bottom
C3  39.68,101.31 0 top
C4  160.3,71.31 0 top
C5  32.74,53 270 top
C6  123.9,132.6 0 top
C7  43.77,86.71 180 top
C8  83.62,56.56 90 top
C56  163.1,43.22 180 bottom
C57  157.76,43.22 0 bottom
DISPLAY1  107.28,35.84 0 top
ENCODER  160.58,32.55 180 top
HIGHVOLTAGE  198.68,75 0 top
IC1  61.52,119.65 0 top
IC2  61.52,104.11 0 top
LED1  140.77,28.41 270 top
LED2  138.11,28.43 270 top
LED3  143.36,28.41 270 top
LED4  145.9,28.41 270 top
LED5  142.14,66.01 180 top
LED6  146.41,62.75 270 top
LED7  137.87,62.75 270 top
LED8  142.14,59.71 0 top
LED_3.3  160.59,56.94 180 top
LED_5  160.58,61.84 0 top
LED_RGB  190.47,130.19 90 top
PROGRAM  67.87,21.45 180 top
PWR  158.75,74.64 0 top
QUANTUM_CONNECTOR  107.17,124.81 0 top
R1  137.51,21.02 90 bottom
R2  137.34,52.11 270 bottom
R3  160.58,61.84 180 bottom
R4  142.14,66.01 0 bottom
R5  193.83,123.11 270 top
R6  147.07,46.14 90 bottom
R7  160.56,56.89 0 bottom
R8  186.95,123.11 270 top
R9  190.44,123.13 270 top
R10  140.67,21.02 90 bottom
R11  146.41,62.75 270 bottom
R12  18.34,86.66 0 top
R13  146.84,21.02 90 bottom
R14  143.74,21.02 90 bottom
R16  137.87,62.75 270 bottom
R17  142.14,59.71 180 bottom
R62  137.34,46.14 90 bottom
R63  140.62,46.14 270 bottom
R64  143.84,46.14 270 bottom
R65  107.27,63.31 0 bottom
R66  107.24,59.99 0 bottom
SPI  73.18,56.66 180 top
SW  142.09,37.41 0 top
TEENSY3.2_2  43.82,63.06 180 top
U$1  [PHOENIX]  153.96,119.77 180 top
U$5  96.88,53.15 0 top
U$9  44.2,100.83 0 top
USB  62.03,26.28 0 top
USB_2  67.87,40.76 180 top

### Tracks (layer width: path | path; a pad name or v marks a point on that pad's centre or on a via)
3.3V  (via drill 0.51, 0.89, 0.9 pad 1.68)
  Top 0.305: DISPLAY1.RST 129,33.3 130.25,34.56 130.25,38.52 129.19,39.59 125.53,39.59 124.31,40.81 124.31,42.64 125.07,43.4 127.54,43.4 DISPLAY1.LED
  Top 0.406: 42.93,99.46 47.83,104.36 56.34,104.36 57.08,105.1 IC2.16 57.08,103.62 v57.41,103.29 | IC1.16 56.97,122.34 v44.3,122.34 | IC1.10 64.72,122.48 64.72,123.26 65.18,123.71 v71.73,123.71 | 64.72,106.88 IC2.10 v64.7,105.53
  Top 0.813: TEENSY3.2_2.3.3V1 46.36,85.89 C7.+ 42.93,89.32 U$9.VCC 42.93,99.46 C3.2 41.23,101.46 | TEENSY3.2_2.3.3V 32.77,51.63 C5.2 | QUANTUM_CONNECTOR.26 119.87,129.33 C6.+ | U$5.3.3 107.04,57.98 108.46,59.4 116.32,59.4 127.6,48.12 127.6,47.97 | 127.6,47.97 DISPLAY1.LED | 127.6,47.97 129.43,49.8 144.58,49.8 154.18,59.4 161.34,59.4 162.02,58.73 LED_3.3.A 165.92,60.84 165.92,67.02 161.7,71.23 C4.2 161.95,71.57 161.95,72.36 161.29,73.02 PWR.3 165.76,74.64 177.19,86.07 196.88,86.07 198.75,87.94 v198.75,90.33 v201.29,90.33 v203.83,90.33 v206.37,90.33
  Bottom 0.406: 42.93,122.34 v44.3,122.34 47.2,125.24 60.46,125.24 62.44,127.22 70.97,127.22 71.58,126.61 v71.73,123.71 | R12.E 15.8,100.4 18.7,103.29 41.86,103.29 42.93,102.23 | TEENSY3.2_2.3.3V 40.19,51.63 41.25,52.7 41.25,59.4 39.73,60.93 39.73,62.78 TEENSY3.2_2.3.3V2 41.38,64.33 42.57,65.52 42.57,80.99 43.08,81.5 45.75,81.5 46.36,80.89 TEENSY3.2_2.3.3V1 | v57.41,103.29 57.48,103.22 62.26,103.22 64.57,105.53 v64.7,105.53
  Bottom 0.813: C2.2 122.38,132.35 C6.+ | QUANTUM_CONNECTOR.26 119.87,136.39 116.11,140.15 46.41,140.15 42.93,136.67 42.93,122.34 42.93,102.23 U$9.VCC | R2.1 136.2,53.51 | 136.2,53.51 130.55,53.51 127.6,50.56 DISPLAY1.LED | DISPLAY1.VCC 135.55,25.68 137.57,27.7 147.48,27.7 149.46,29.68 149.46,50.56 146.41,53.61 136.3,53.61 136.2,53.51 | TEENSY3.2_2.3.3V1 46.36,81.27 48.26,83.18 52.38,83.18 55.88,79.67 89.51,79.67 R65.2 105.84,63.29 R66.2 105.84,56.79 107.04,55.59 U$5.3.3
5V  (via drill 0.9 pad 1.68)
  Top 0.813: PWR.1 156.21,77.89 157.99,79.67 167.77,79.67 v178.43,90.33 v180.97,90.33 v183.51,90.33 v186.05,90.33 | PWR.1 87.73,74.64 78.13,65.04 78.13,55.29 | 78.13,55.29 75.82,55.29 SPI.2 | C8.+ 78.64,54.78 78.13,55.29 | PWR.1 156.21,64.79 LED_5.A
  Bottom 0.813: QUANTUM_CONNECTOR.25 119.87,119.78 122.48,117.16 149.46,117.16 154.18,112.44 154.18,76.67 PWR.1
BLUE  (via drill 0.41 pad 0.81, 0.9 pad 1.68)
  Top 0.305: v81.13,111.47 80.72,111.07 80.72,110.91 68.84,99.03 68.84,77.38 55.78,64.33 TEENSY3.2_2.6 | v90.02,111.37 v174.76,111.37
  Top 0.813: R5.2 193.83,119.77 189.23,115.18 185.88,115.18 183.44,112.74 183.44,110.71 v183.51,110.65
  Bottom 0.305: v81.13,111.47 81.49,111.52 81.64,111.37 v90.02,111.37 | v174.76,111.37 176.13,112.74 182.98,112.74 183.44,112.28 183.44,110.71 v183.51,110.65
BT-RX_TEENSY-TX
  Top 0.305: TEENSY3.2_2.8 51.49,69.46 55.73,69.46 58.78,72.36 58.78,82.57 49.79,91.56 46.74,91.56 44.2,94.1 44.2,97.1 44.45,97.35 46.89,97.35 48.01,96.23 U$9.RX
BT-TX_TEENSY-RX
  Top 0.305: TEENSY3.2_2.7 55.73,66.87 59.54,70.68 59.54,83.02 50.09,92.47 47.04,92.47 45.47,94.05 U$9.TX
CLOCK  (via drill 0.51)
  Top 0.305: v36.38,83.48 34.7,85.16 34.7,108.47 35.61,109.39 57.89,109.39 | 57.89,109.39 62.89,109.39 63.5,108.78 63.5,106.98 IC2.11 | IC1.11 63.43,123.33 64.42,124.32 65.79,124.32 v66.7,125.24 | v56.95,110.3 57.89,109.39
  Bottom 0.305: TEENSY3.2_2.21/A7 36.22,59.25 38.05,61.08 38.05,68.7 39.42,70.07 39.42,72.05 37.44,74.03 37.44,82.41 v36.38,83.48 | v66.7,125.24 65.79,124.32 64.42,124.32 63.5,123.41 58.93,123.41 56.34,120.82 56.34,110.91 v56.95,110.3
CS
  Top 0.305: DISPLAY1.CS 89.09,30.76 75.39,44.47 54.21,44.47 54.05,44.31 50.09,44.31 48.72,45.69 48.72,73.27 49.94,74.49 TEENSY3.2_2.10
D+
  Top 0.305: USB.D+ 66.86,31.06 65.33,32.58 65.33,35.32 67.85,37.84 67.85,40.73 USB_2.3
D-
  Top 0.305: USB.D- 66.86,34.03 70.41,37.58 USB_2.2
DATA-IN  (via drill 0.41 pad 0.81)
  Top 0.305: TEENSY3.2_2.17/A3 31.85,69.41 28.76,72.51 28.76,121.28 40.34,132.86 59.54,132.86 v59.54,133.16 | v59.54,126.51 59.54,122.53 IC1.14
  Bottom 0.305: v59.54,133.16 v59.54,126.51
DATA-OUT  (via drill 0.51)
  Top 0.305: IC1.9 67.42,122.45 v67.47,122.5 | v59.69,104.82 59.62,104.89 IC2.14
  Bottom 0.305: v67.47,122.5 67.47,121.28 59.69,113.5 v59.69,104.82
DC  (via drill 0.41 pad 0.81)
  Top 0.305: DISPLAY1.DC 121.33,35.84 117,31.51 89.41,31.51 75.7,45.23 55.43,45.23 v54.97,45.84 | TEENSY3.2_2.A10 38.79,56.66 45.67,56.66 47.04,55.29 47.04,44.92 49.48,42.49 v54.97,42.49
  Bottom 0.305: v54.97,45.84 v54.97,42.49
DIPSW  (via drill 0.41)
  Top 0.305: TEENSY3.2_2.A13 39.86,63.11 33.28,63.11 v32.77,63.21 | v21.44,63.21 21.29,63.06 21.29,57.57 26.93,51.93 26.93,43.55 32.11,38.37 40.64,38.37 43.84,35.17 52.68,35.17 53.9,33.95 53.9,22.37 57.56,18.71 v57.56,18.1 | v131.93,23.44 131.93,44.62 134.83,47.51 v135.59,47.51
  Bottom 0.305: v32.77,63.21 v21.44,63.21 | v57.56,18.1 57.86,17.8 125.68,17.8 131.17,23.28 v131.93,23.44 | v135.59,47.51 137.31,47.51 R62.2 | R62.2 R63.1 R64.1 | R64.1 144.3,47.54 144.43,47.67 143.97,47.67 R64.1 | R64.1 R6.2 | R62.2 R2.2
DIR  (via drill 0.41)
  Top 0.305: TEENSY3.2_2.22/A8 36.2,56.23 37.44,54.98 37.44,53.31 38.05,52.7 44.3,52.7 45.37,51.63 v45.37,42.64 | v46.59,40.35 47.65,39.28 55.12,39.28 57.86,36.54 57.86,23.89 60.15,21.61 157.08,21.61 159.67,24.2 159.67,33.95 163.02,37.3 163.02,39.99 ENCODER.A
  Bottom 0.305: v45.37,42.64 45.37,41.57 v46.59,40.35
  Bottom 0.813: ENCODER.A 164.5,41.47 C56.2
GND  (via drill 0.5, 0.51, 0.9 pad 1.68)  (2 unrouted)
  Top 0.254: IC1.13 60.91,122.48 60.91,124.15 v62.44,125.67
  Top 0.305: IC2.8 66.7,101.31 67.16,101.77 v67.16,102.38 | v61.98,104.82 60.89,105.91 IC2.13
  Bottom 0.254: v62.44,125.67 63.05,126.28 68.08,126.28 69.24,125.11 69.24,124.81
  Bottom 0.813: ENCODER.C 160.58,43.25 161.67,43.25 C56.1 C57.1 | C2.1 125.18,132.1 C6.-
  other vias: 188.59,90.33 191.13,90.33 193.67,90.33 196.21,90.33 27.23,60.01 28.6,60.01 46.28,65.19 46.28,63.67 46.28,62.14 46.28,60.62 27.23,58.64 28.6,58.64 46.28,77.23 50.7,111.22 50.7,112.59 55.12,114.27 55.12,112.44 50.7,113.96 50.7,115.33 61.83,110.91 61.83,112.13 63.05,112.13 63.05,110.91 158.14,68.55 159.36,68.55 159.36,69.76 158.14,69.76 61.37,19.78 62.13,18.86 34.85,42.94 36.07,42.94 37.29,42.94 39.42,86.68 38.2,86.68 38.2,85.46 39.42,85.46 148.57,59.76 155.55,61.66 154.28,61.66 147.3,58.49 76.18,82.62
  pour Bottom: -15.21,153.38 230.53,153.38 230.53,-13.62 -15.85,-13.62 -15.85,153.38
  pour Top: -15.85,153.38 230.53,153.38 230.53,-0.29 230.53,-13.62 -15.85,-13.62
GREEN  (via drill 0.9 pad 1.68)
  Top 0.305: TEENSY3.2_2.25 43.82,68.98 43.01,68.16 31.58,68.16 27.99,71.75 27.99,121.73 39.88,133.62 58.02,133.62 58.63,134.23 60.3,134.23 61.83,132.71 118.67,132.71 121.42,135.45 129.64,135.45 132.69,132.4 132.69,115.33 135.44,112.59 176.94,112.59 v178.43,110.65
  Top 0.813: R8.2 182.05,121.71 178.57,118.23 178.57,110.79 v178.43,110.65
INA1  (via drill 0.51)
  Top 0.305: IC1.15 58.35,127.24 58.78,127.68 85.75,127.68 v86.21,127.22
  Bottom 0.305: v86.21,127.22 87.35,126.08 QUANTUM_CONNECTOR.2
INA2  (via drill 0.51)
  Top 0.229: 61.52,121.43 61.52,123.56
  Top 0.305: IC1.2 58.35,118.25 61.52,121.43 | v83.47,125.24 82.55,126.15 64.11,126.15 61.52,123.56
  Bottom 0.305: v83.47,125.24 83.47,127.98 85.14,129.66 95.35,129.66 97.03,127.98 97.03,126.1 QUANTUM_CONNECTOR.8
INA3  (via drill 0.51)
  Top 0.305: IC1.4 60.89,117.97 63.27,120.36 82.55,120.36 v83.01,120.82
  Bottom 0.305: v83.01,120.82 83.62,120.82 83.92,120.51 100.38,120.51 102.21,122.34 102.21,123.41 QUANTUM_CONNECTOR.11
INA4  (via drill 0.51)
  Top 0.305: IC1.6 63.43,117.69 64.87,119.14 84.08,119.14 86.21,121.28 v86.21,122.65
  Bottom 0.305: v86.21,122.65 86.52,122.65 87.13,122.04 93.98,122.04 94.44,122.5 94.44,123.51 QUANTUM_CONNECTOR.5
INB1  (via drill 0.51)
  Top 0.229: 60.25,121.53 60.25,124.88
  Top 0.305: IC1.1 57.08,118.35 60.25,121.53 | 60.25,124.88 62.28,126.91 84.08,126.91 v84.69,126.31
  Bottom 0.305: v84.69,126.31 84.69,127.52 86.06,128.9 92.92,128.9 94.44,127.37 94.44,126.1 QUANTUM_CONNECTOR.6
INB2
  Top 0.305: IC1.3 59.62,118.08 62.51,120.97 81.33,120.97 88.19,127.83 101.3,127.83 102.21,126.91 102.21,126.2 QUANTUM_CONNECTOR.12
INB3  (via drill 0.51)
  Top 0.305: IC1.5 62.16,117.92 63.99,119.75 83.62,119.75 85.14,121.28 v84.99,121.43
  Bottom 0.305: v84.99,121.43 95.81,121.43 97.03,122.65 97.03,123.51 QUANTUM_CONNECTOR.7
INB4
  Top 0.305: IC1.7 64.7,117.9 65.33,118.53 84.38,118.53 QUANTUM_CONNECTOR.1
LATCH  (via drill 0.51)
  Top 0.305: v40.01,81.75 35.46,86.3 35.46,107.86 36.22,108.63 54.51,108.63 | 54.51,108.63 61.67,108.63 62.13,108.17 62.13,106.93 IC2.12 | 54.51,108.63 54.44,108.55 C1.2 53.07,106.65 v52.53,106.65 | IC1.12 62.16,123.13 64.27,125.24 v64.72,125.24
  Bottom 0.305: TEENSY3.2_2.30 40.34,74.49 40.01,74.82 v40.01,81.75 | v64.72,125.24 64.27,125.24 63.35,124.32 55.88,124.32 53.75,122.19 53.75,107.86 v52.53,106.65
LED1  (via drill 0.51)
  Top 0.254: 58.98,102.18 58.98,99.58
  Top 0.305: IC2.15 58.35,102.81 58.98,102.18 | 58.98,99.58 59.08,99.48 59.08,87.29 61.83,84.55 61.83,74.95 v63.2,73.57 | v135.13,31.51 140.16,31.51 140.77,30.9 LED1.A
  Bottom 0.305: v63.2,73.57 63.2,69 62.44,68.24 62.44,51.17 63.66,49.95 74.63,49.95 85.75,38.83 112.42,38.83 114.1,37.15 129.19,37.15 130.56,35.78 130.56,34.56 133.61,31.51 v135.13,31.51
LED2  (via drill 0.51)
  Top 0.305: IC2.1 57.1,101.28 57.1,86.68 60.3,83.48 60.3,72.2 v60.91,71.59 | v135.23,28.87 136.28,29.91 LED2.A
  Bottom 0.305: v60.91,71.59 60.91,50.11 62.59,48.43 73.71,48.43 84.84,37.3 111.66,37.3 117,31.97 130.31,31.97 133.4,28.87 v135.23,28.87
LED3  (via drill 0.51)
  Top 0.305: v61.52,73.42 61.06,73.88 61.06,83.94 58.35,86.66 IC2.2 | LED3.A 143.36,31.06 v143.51,31.21
  Bottom 0.305: v61.52,73.42 61.52,72.81 62.13,72.2 62.13,69.76 61.67,69.31 61.67,50.56 63.05,49.19 74.17,49.19 85.3,38.07 111.97,38.07 115.47,34.56 129.19,34.56 133.3,30.45 142.75,30.45 v143.51,31.21
LED4  (via drill 0.51)
  Top 0.305: IC2.3 59.62,100.47 60,100.09 60,87.75 62.59,85.16 62.59,76.17 v63.35,75.4 | v133,36.08 147.02,36.08 149,34.1 149,30.75 148.24,29.99 146.05,29.99 LED4.A
  Bottom 0.305: v63.35,75.4 63.5,75.4 64.72,74.18 64.72,68.55 63.2,67.02 63.2,51.78 64.27,50.71 75.09,50.71 86.06,39.74 129.34,39.74 v133,36.08
LED5  (via drill 0.6)
  Top 0.305: v145.19,66.11 145.09,66.01 LED5.A | 60.99,101.2 IC2.4 60.89,100.12 v61.22,99.79
  Bottom 0.305: v61.22,99.79 67.31,99.79 73.71,106.19 144.73,106.19 149.15,101.77 149.15,69.76 145.49,66.11 v145.19,66.11
LED6  (via drill 0.6)
  Top 0.305: v68.84,106.65 68.23,106.04 68.23,101.77 66.55,100.09 62.69,100.09 62.16,100.63 IC2.5 | v149.15,66.26 148.49,66.26 LED6.A
  Bottom 0.305: v68.84,106.65 69.14,106.95 145.19,106.95 149.91,102.23 149.91,67.02 v149.15,66.26
LED7  (via drill 0.6)
  Top 0.305: v147.63,56.51 147.63,56.05 146.56,54.98 136.05,54.98 133.76,57.27 133.76,61.99 135.89,64.13 137.82,64.13 LED7.A | IC2.6 63.53,101.41 63.53,103.22 64.8,104.49 66.7,104.49 67.47,105.25 v67.47,107.26
  Bottom 0.305: v67.47,107.26 67.92,107.71 145.49,107.71 150.68,102.53 150.68,59.25 147.78,56.35 v147.63,56.51
LED8  (via drill 0.51, 0.6)
  Top 0.305: v140.77,56.05 140.77,59.66 LED8.A | IC2.7 64.8,101.41 64.8,103.22 65.1,103.52 v65.33,103.52
  Bottom 0.305: v140.77,56.05 141.23,55.59 148.09,55.59 151.44,58.94 151.44,102.84 145.8,108.47 66.25,108.47 66.07,108.3 66.07,104.26 v65.33,103.52
LED_3.3  (via drill 0.51)
  Top 0.305: LED_3.3.C 156.49,56.94 v156.47,56.96
  Bottom 0.305: v156.47,56.96 159.08,56.96 R7.2
LINEA1
  Top 0.305: TEENSY3.2_2.2 51.49,54.22 55.73,54.22 71.89,70.37 71.89,97.81 87.73,113.66 104.5,113.66 107.17,116.32 QUANTUM_CONNECTOR.15
LINEA2  (via drill 0.41 pad 0.81)
  Top 0.305: TEENSY3.2_2.3 51.49,56.66 55.73,56.66 71.12,72.05 71.12,98.11 87.43,114.42 103.89,114.42 104.04,114.57 v104.04,114.72 | v109.68,114.88 109.71,114.9 QUANTUM_CONNECTOR.17
  Bottom 0.305: v104.04,114.72 104.19,114.88 v109.68,114.88
LINEA3  (via drill 0.41)
  Top 0.305: TEENSY3.2_2.31 38.15,71.95 36.91,73.19 32.03,73.19 v31.65,73.57 | v19.61,73.57 19.61,79.06 24.95,84.4 24.95,123.41 38.66,137.13 98.71,137.13 99.32,137.74 111.36,137.74 v112.12,136.97 | v113.64,128.59 113.49,128.44 113.49,124.78 QUANTUM_CONNECTOR.19
  Bottom 0.305: v31.65,73.57 v19.61,73.57 | v112.12,136.97 112.12,130.12 v113.64,128.59
LINEA4  (via drill 0.41)
  Top 0.305: TEENSY3.2_2.24 46.13,66.87 46.89,67.63 46.89,73.73 49.79,76.62 49.79,78.15 50.24,78.6 50.24,81.5 52.07,83.33 56.04,83.33 v56.19,83.48 | v65.94,92.93 66.7,92.93 67.31,93.54 67.31,99.79 82.1,114.57 83.77,114.57 v84.23,115.03 | v111.97,116.55 113.95,116.55 114.86,117.47 114.86,123.46 QUANTUM_CONNECTOR.21
  Bottom 0.305: v56.19,83.48 v65.94,92.93 | v84.23,115.03 89.41,115.03 90.94,116.55 v111.97,116.55
LINEA5  (via drill 0.51)
  Top 0.305: v74.78,77.69 74.78,78.91 74.17,79.52 74.17,96.74 87.28,109.85 v88.04,109.85
  Bottom 0.305: TEENSY3.2_2.27 49.03,74.49 50.3,75.76 59.59,75.76 61.37,77.54 74.63,77.54 v74.78,77.69 | QUANTUM_CONNECTOR.23 117.45,123.41 117.45,115.18 112.12,109.85 v88.04,109.85
LINEA6  (via drill 0.41)
  Top 0.305: TEENSY3.2_2.26 43.44,71.95 42.17,70.68 v38.36,70.68 | v18.39,75.1 18.39,79.06 24.18,84.85 24.18,123.71 38.36,137.89 98.4,137.89 99.01,138.5 106.78,138.5 v107.09,138.8
  Bottom 0.305: v38.36,70.68 34.7,70.68 33.63,71.75 33.63,73.42 31.96,75.1 v18.39,75.1 | v107.09,138.8 107.09,126.15 QUANTUM_CONNECTOR.16
LINEA7
  Top 0.305: TEENSY3.2_2.14/A0 32.31,77.03 31.04,78.3 31.04,119.75 41.56,130.27 108,130.27 109.68,128.59 109.68,126.1 QUANTUM_CONNECTOR.18
LINEA8
  Top 0.305: TEENSY3.2_2.15/A1 32.11,74.49 30.28,76.32 30.28,120.21 41.1,131.03 110.59,131.03 112.27,129.35 112.27,126.1 QUANTUM_CONNECTOR.20
LINEA9
  Top 0.305: TEENSY3.2_2.16/A2 31.91,71.95 29.52,74.34 29.52,120.67 40.8,131.94 112.12,131.94 114.86,129.2 114.86,126.15 QUANTUM_CONNECTOR.22
LINEAANT  (via drill 0.41)
  Top 0.305: TEENSY3.2_2.33 38.51,66.87 37.29,65.65 32.11,65.65 v31.8,65.95 | v21.44,66.11 21.44,76.78 v23.27,78.6 | v26.01,81.35 26.47,81.8 26.47,122.8 39.27,135.6 116.23,135.6 v117.3,134.53
  Bottom 0.305: v31.8,65.95 21.59,65.95 v21.44,66.11 | v23.27,78.6 v26.01,81.35 | v117.3,134.53 117.3,126.1 QUANTUM_CONNECTOR.24
MISO
  Top 0.305: TEENSY3.2_2.12 51.49,79.52 52.68,79.52 53.6,78.6 53.6,74.03 52.81,73.24 50.22,73.24 49.63,72.66 49.63,45.99 50.55,45.08 52.99,45.08 53.75,45.84 53.75,46.45 54.66,47.36 58.02,47.36 58.63,46.75 67.01,46.75 68.38,48.12 68.38,58.49 69.6,59.71 74.78,59.71 75.7,58.79 75.7,57.95 SPI.1
MOSI  (via drill 0.41 pad 0.81)
  Top 0.305: DISPLAY1.SDA 122.65,38.38 116.54,32.27 89.72,32.27 76,45.99 | 76,45.99 57.25,45.99 v56.95,46.3 | v56.95,43.25 56.65,43.55 49.63,43.55 47.81,45.38 47.81,73.4 TEENSY3.2_2.11 | 76,45.99 73.18,48.81 SPI.4
  Bottom 0.305: v56.95,46.3 v56.95,43.25
N$1  (via drill 0.41 pad 0.81)
  Top 0.305: v137.42,24.65 137.42,26.32 LED2.C
  Bottom 0.305: v137.42,24.65 137.42,22.52
  Bottom 0.406: R1.2 137.42,22.52
N$2  (via drill 0.51)
  Top 0.305: LED_5.C 162,64.23 v161.95,64.28
  Bottom 0.305: v161.95,64.28 161.95,61.87 R3.2
N$3  (via drill 0.6)
  Top 0.305: LED5.C 138.89,66.01 v138.79,66.11
  Bottom 0.305: v138.79,66.11 140.64,66.11 R4.2
N$5  (via drill 0.6)
  Top 0.305: v144.58,61.54 144.88,61.23 146.31,61.23 LED6.C
  Bottom 0.305: R11.2 144.76,61.35 v144.58,61.54
N$6  (via drill 0.6)
  Top 0.305: LED7.C v137.87,59.1
  Bottom 0.305: v137.87,59.1 R16.2
N$7  (via drill 0.9 pad 1.68)
  other vias: 178.43,100.49
N$8
  Top 0.813: R5.1 193.83,126.53 LED_RGB.3
N$9  (via drill 0.9 pad 1.68)
  other vias: 203.83,108.11
N$10
  Top 0.813: LED_RGB.1 188.7,128.19 186.95,126.43 R8.1
N$11
  Top 0.813: LED_RGB.2 190.47,124.56 R9.1
N$12  (via drill 0.41 pad 0.81)
  Top 0.305: LED1.C 140.82,26.94 140.82,24.71 v140.77,24.65
  Bottom 0.305: v140.77,24.65 140.77,22.52
  Bottom 0.406: R10.2 140.77,22.52
N$13  (via drill 0.41 pad 0.81)
  Top 0.305: v146.56,24.65 146.56,26.33 LED4.C
  Bottom 0.305: v146.56,24.65 146.56,22.7
  Bottom 0.406: R13.2 146.56,22.7
N$14  (via drill 0.51)
  Top 0.305: v143.36,24.65 LED3.C
  Bottom 0.305: v143.36,24.65 143.36,22.8 R14.2
N$16  (via drill 0.6)
  Top 0.305: v145.49,59.71 LED8.C
  Bottom 0.305: R17.2 v145.49,59.71
N$18
  Bottom 0.406: SW.6 143.84,41.7 R64.2
N$20
  Bottom 0.406: SW.8 137.34,42.15 R62.1
N$21  (via drill 0.9 pad 1.68)
  other vias: 186.05,108.11
N$22  (via drill 0.9 pad 1.68)
  other vias: 186.05,105.57
N$23  (via drill 0.9 pad 1.68)
  other vias: 188.59,105.57
N$24  (via drill 0.9 pad 1.68)
  other vias: 191.13,105.57
N$25  (via drill 0.9 pad 1.68)
  other vias: 193.67,105.57
N$26  (via drill 0.9 pad 1.68)
  other vias: 178.43,95.41
N$27  (via drill 0.9 pad 1.68)
  other vias: 196.21,108.11
N$28  (via drill 0.9 pad 1.68)
  other vias: 196.21,105.57
N$34  (via drill 0.9 pad 1.68)
  other vias: 196.21,103.03
N$35  (via drill 0.9 pad 1.68)
  other vias: 193.67,103.03
N$36  (via drill 0.9 pad 1.68)
  other vias: 191.13,103.03
N$37  (via drill 0.9 pad 1.68)
  other vias: 188.59,103.03
N$38  (via drill 0.9 pad 1.68)
  other vias: 186.05,103.03
N$39  (via drill 0.9 pad 1.68)
  other vias: 186.05,100.49
N$40  (via drill 0.9 pad 1.68)
  other vias: 188.59,100.49
N$41  (via drill 0.9 pad 1.68)
  other vias: 191.13,100.49
N$42  (via drill 0.9 pad 1.68)
  other vias: 193.67,100.49
N$44  (via drill 0.9 pad 1.68)
  other vias: 186.05,92.87
N$45  (via drill 0.9 pad 1.68)
  other vias: 186.05,95.41
N$51  (via drill 0.9 pad 1.68)
  other vias: 191.13,95.41
N$52  (via drill 0.9 pad 1.68)
  other vias: 188.59,95.41
N$54  (via drill 0.9 pad 1.68)
  other vias: 188.59,92.87
N$57  (via drill 0.9 pad 1.68)
  other vias: 191.13,92.87
N$61  (via drill 0.9 pad 1.68)
  other vias: 193.67,92.87
N$62  (via drill 0.9 pad 1.68)
  other vias: 193.67,95.41
N$64  (via drill 0.9 pad 1.68)
  other vias: 196.21,92.87
N$65  (via drill 0.9 pad 1.68)
  other vias: 196.21,95.41
N$66  (via drill 0.9 pad 1.68)
  other vias: 196.21,97.95
N$67  (via drill 0.9 pad 1.68)
  other vias: 196.21,100.49
N$68  (via drill 0.9 pad 1.68)
  other vias: 193.67,97.95
N$81  (via drill 0.9 pad 1.68)
  other vias: 191.13,97.95
N$92  (via drill 0.9 pad 1.68)
  other vias: 188.59,97.95
N$93  (via drill 0.9 pad 1.68)
  other vias: 186.05,97.95
N$94  (via drill 0.9 pad 1.68)
  other vias: 178.43,97.95
N$95  (via drill 0.9 pad 1.68)
  other vias: 191.13,108.11
N$96
  Bottom 0.406: SW.5 147.07,42.38 R6.1
N$97
  Bottom 0.406: SW.7 140.47,41.57 140.47,44.16 140.62,44.31 R63.2
N$98  (via drill 0.9 pad 1.68)
  other vias: 178.43,105.57
N$133  (via drill 0.9 pad 1.68)
  other vias: 178.43,103.03
N$134  (via drill 0.9 pad 1.68)
  other vias: 180.97,108.11
N$135  (via drill 0.9 pad 1.68)
  other vias: 183.51,108.11
N$136  (via drill 0.9 pad 1.68)
  other vias: 180.97,105.57
N$137  (via drill 0.9 pad 1.68)
  other vias: 178.43,108.11
N$138  (via drill 0.9 pad 1.68)
  other vias: 206.37,108.11
N$139  (via drill 0.9 pad 1.68)
  other vias: 183.51,105.57
N$140  (via drill 0.9 pad 1.68)
  other vias: 183.51,103.03
N$141  (via drill 0.9 pad 1.68)
  other vias: 180.97,103.03
N$142  (via drill 0.9 pad 1.68)
  other vias: 201.29,108.11
N$143  (via drill 0.9 pad 1.68)
  other vias: 193.67,108.11
N$144  (via drill 0.9 pad 1.68)
  other vias: 188.59,108.11
N$145  (via drill 0.9 pad 1.68)
  other vias: 203.83,110.65
N$146  (via drill 0.9 pad 1.68)
  other vias: 198.75,110.65
N$147  (via drill 0.9 pad 1.68)
  other vias: 178.43,92.87
N$148  (via drill 0.9 pad 1.68)
  other vias: 180.97,100.49
N$149  (via drill 0.9 pad 1.68)
  other vias: 191.13,110.65
N$150  (via drill 0.9 pad 1.68)
  other vias: 186.05,110.65
N$151  (via drill 0.9 pad 1.68)
  other vias: 196.21,110.65
N$155  (via drill 0.9 pad 1.68)
  other vias: 206.37,110.65
N$157  (via drill 0.9 pad 1.68)
  other vias: 201.29,110.65
N$159  (via drill 0.9 pad 1.68)
  other vias: 180.97,92.87
N$160  (via drill 0.9 pad 1.68)
  other vias: 180.97,95.41
N$162  (via drill 0.9 pad 1.68)
  other vias: 183.51,92.87
N$163  (via drill 0.9 pad 1.68)
  other vias: 183.51,95.41
N$164  (via drill 0.9 pad 1.68)
  other vias: 183.51,97.95
N$165  (via drill 0.9 pad 1.68)
  other vias: 183.51,100.49
N$166  (via drill 0.9 pad 1.68)
  other vias: 180.97,97.95
N$167  (via drill 0.9 pad 1.68)
  other vias: 193.67,110.65
N$168  (via drill 0.9 pad 1.68)
  other vias: 188.59,110.65
N$276  (via drill 0.9 pad 1.68)
  other vias: 198.75,108.11
N$277  (via drill 0.9 pad 1.68)
  other vias: 198.75,105.57
N$278  (via drill 0.9 pad 1.68)
  other vias: 201.29,105.57
N$279  (via drill 0.9 pad 1.68)
  other vias: 203.83,105.57
N$280  (via drill 0.9 pad 1.68)
  other vias: 206.37,105.57
N$285  (via drill 0.9 pad 1.68)
  other vias: 206.37,103.03
N$286  (via drill 0.9 pad 1.68)
  other vias: 203.83,103.03
N$287  (via drill 0.9 pad 1.68)
  other vias: 201.29,103.03
N$288  (via drill 0.9 pad 1.68)
  other vias: 198.75,103.03
N$289  (via drill 0.9 pad 1.68)
  other vias: 198.75,100.49
N$290  (via drill 0.9 pad 1.68)
  other vias: 201.29,100.49
N$291  (via drill 0.9 pad 1.68)
  other vias: 203.83,100.49
N$292  (via drill 0.9 pad 1.68)
  other vias: 206.37,100.49
N$294  (via drill 0.9 pad 1.68)
  other vias: 198.75,92.87
N$295  (via drill 0.9 pad 1.68)
  other vias: 198.75,95.41
N$296  (via drill 0.9 pad 1.68)
  other vias: 203.83,95.41
N$297  (via drill 0.9 pad 1.68)
  other vias: 201.29,95.41
N$299  (via drill 0.9 pad 1.68)
  other vias: 201.29,92.87
N$301  (via drill 0.9 pad 1.68)
  other vias: 203.83,92.87
N$303  (via drill 0.9 pad 1.68)
  other vias: 206.37,92.87
N$304  (via drill 0.9 pad 1.68)
  other vias: 206.37,95.41
N$310  (via drill 0.9 pad 1.68)
  other vias: 206.37,97.95
N$311  (via drill 0.9 pad 1.68)
  other vias: 203.83,97.95
N$312  (via drill 0.9 pad 1.68)
  other vias: 201.29,97.95
N$313  (via drill 0.9 pad 1.68)
  other vias: 198.75,97.95
PALLA  (via drill 0.41)
  Top 0.305: TEENSY3.2_2.28 43.34,77.03 42.01,75.71 34.09,75.71 v33.94,75.86 | v32.87,84.24 32.57,84.55 32.57,118.84 42.17,128.44 102.34,128.44 103.36,127.42 103.36,124.81 QUANTUM_CONNECTOR.13
  Bottom 0.305: v33.94,75.86 33.94,78.15 34.24,78.45 34.24,82.87 v32.87,84.24
PROGRAM
  Top 0.406: PROGRAM.A2 64.42,24.22 64.42,37.15 62.79,38.78 USB_2.5
PULS  (via drill 0.41)
  Top 0.305: TEENSY3.2_2.23/A9 36.2,53.64 37.9,51.93 43.39,51.93 44.3,51.02 44.3,43.09 v43.84,42.64 | v45.06,39.28 45.98,38.37 54.66,38.37 57.1,35.93 57.1,23.44 59.69,20.84 158.3,20.84 161.34,23.89 161.34,33.34 166.83,38.83 166.83,41.27 165.76,42.33 159.21,42.33 158.14,41.27 158.14,40.12 ENCODER.B
  Bottom 0.305: v43.84,42.64 43.84,40.5 v45.06,39.28
  Bottom 0.813: ENCODER.B 156.36,41.77 C57.2
PWM1
  Top 0.305: TEENSY3.2_2.5 51.49,61.84 55.73,61.84 69.6,75.71 69.6,98.72 90.66,119.78 90.66,124.91 91.82,126.08 QUANTUM_CONNECTOR.4
PWM2  (via drill 0.41 pad 0.81)
  Top 0.305: TEENSY3.2_2.9 51.69,72.2 55.58,72.2 57.71,74.34 v57.71,81.96 | v67.47,91.25 68.08,91.86 68.08,99.33 80.11,111.37 80.11,111.67 81.49,113.05 v82.55,113.05 | v91.54,115.48 97.18,115.48 98.25,116.55 98.25,124.78 QUANTUM_CONNECTOR.10
  Bottom 0.305: v82.55,113.05 90.48,113.05 91.54,114.11 v91.54,115.48 | v57.71,81.96 67.01,91.25 v67.47,91.25
PWM3  (via drill 0.41)
  Top 0.305: TEENSY3.2_2.32 38.26,69.41 36.99,70.68 v31.96,70.68 | v101.3,136.67 100.99,136.36 38.97,136.36 25.71,123.1 25.71,83.63 20.53,78.45 20.53,72.2 v19.92,71.59
  Bottom 0.305: v101.3,136.67 101.3,127.83 100.84,127.37 100.84,124.83 QUANTUM_CONNECTOR.9 | v31.96,70.68 20.83,70.68 v19.92,71.59
PWM4
  Top 0.305: TEENSY3.2_2.4 55.73,59.25 70.36,73.88 70.36,98.42 91.93,119.98 QUANTUM_CONNECTOR.3
RED  (via drill 0.41 pad 0.81, 0.9 pad 1.68)
  Top 0.305: TEENSY3.2_2.20/A6 31.85,61.79 27.23,66.41 27.23,122.19 39.42,134.38 57.71,134.38 58.32,134.99 60.76,134.99 62.28,133.47 118.21,133.47 121.11,136.36 130.1,136.36 133.45,133.01 133.45,115.79 135.89,113.35 175.36,113.35 v176.58,114.57 | v180.85,117.31 180.85,115.94 181,115.79
  Top 0.813: R9.2 190.44,120.04 188.32,117.92 182.98,117.92 181,115.94 181,115.79 181,110.66 v181.02,110.65
  Bottom 0.305: v176.58,114.57 179.48,114.57 179.94,115.03 179.94,116.4 v180.85,117.31
SCK  (via drill 0.41, 0.41 pad 0.81)
  Top 0.305: DISPLAY1.SCK 129.38,40.92 131.17,39.13 131.17,30.9 129.8,29.53 124.16,29.53 123.7,29.99 88.65,29.99 74.93,43.7 | 74.93,43.7 58.47,43.7 58.02,43.25 58.02,42.64 57.71,41.42 33.94,41.42 30.28,45.08 30.28,53.46 25.4,58.33 v25.4,76.32 | v33.23,79.57 TEENSY3.2_2.13 | 74.93,43.7 74.17,42.94 v74.17,42.64 | v72.95,47.06 71.89,48.12 71.91,53.13 71.91,56.91 72.93,57.93 SPI.3
  Bottom 0.305: v74.17,42.64 72.95,43.86 v72.95,47.06 | v33.23,79.57 28.65,79.57 v25.4,76.32
SCL  (via drill 0.41)
  Top 0.305: TEENSY3.2_2.19/A5 30.84,64.33 v30.43,64.74 | v23.57,64.58 23.57,57.73 28.6,52.7 28.6,44.31 33.02,39.89 41.56,39.89 44.76,36.69 53.75,36.69 55.58,34.87 55.58,22.83 61.37,17.03 107.85,17.03 v110.9,19.47 | v111.2,33.19 112.12,34.1 U$5.SCL
  Bottom 0.305: R65.1 108.77,63.21 110.14,63.21 111.03,62.32 111.03,55.52 U$5.SCL | v30.43,64.74 23.73,64.74 v23.57,64.58 | v110.9,19.47 110.9,32.88 v111.2,33.19
SDA  (via drill 0.41)
  Top 0.305: TEENSY3.2_2.18/A4 v28.91,66.87 | v23.27,66.87 22.36,65.95 22.36,57.73 27.69,52.39 27.69,44.01 32.57,39.13 41.1,39.13 44.3,35.93 53.14,35.93 54.66,34.41 54.66,22.67 61.52,15.82 v61.52,15.36 | v70.97,15.36 109.07,15.36 v113.34,19.63 | v110.14,34.87 110.14,52.54 109.68,53 109.68,54.32 U$5.SDA
  Bottom 0.305: 108.49,59.83 R66.1 108.64,55.36 U$5.SDA | v28.91,66.87 v23.27,66.87 | v61.52,15.36 61.52,15.66 62.59,17.03 69.6,17.03 v70.97,15.36 | v113.34,19.63 113.34,33.8 112.58,34.56 110.44,34.56 v110.14,34.87
SEL  (via drill 0.41)
  Top 0.305: TEENSY3.2_2.A11 38.74,58.72 37.44,57.42 37.44,55.9 37.9,55.44 45.22,55.44 46.13,54.52 46.13,43.55 v47.2,42.49 | v49.18,40.5 55.12,40.5 58.63,37 58.63,24.35 60.61,22.37 154.9,22.37 ENCODER.E
  Bottom 0.305: v47.2,42.49 v49.18,40.5
SOLENOIDE
  Top 0.305: TEENSY3.2_2.29 40.01,78.3 32.41,78.3 31.8,78.91 31.8,119.29 41.86,129.35 103.28,129.35 104.65,127.98 104.65,126.1 QUANTUM_CONNECTOR.14
SPEED  (via drill 0.41)
  Top 0.305: TEENSY3.2_2.A12 42.5,60.47 31.8,60.47 26.47,65.8 26.47,77.23 24.18,79.52 v24.18,80.74
  Bottom 0.305: v24.18,80.74 20.37,84.4 19,84.4 18.34,85.06 R12.S
TEENSY1-RX_TEENSY2-TX
  Top 0.305: QUANTUM_CONNECTOR.29 124.95,113.99 124.01,113.05 88.19,113.05 72.65,97.5 72.65,68.55 55.88,51.78 51.59,51.78 TEENSY3.2_2.1
TEENSY1-TX_TEENSY2-RX
  Top 0.305: QUANTUM_CONNECTOR.30 129.57,126.08 131.02,124.63 131.02,116.4 127.05,112.44 88.65,112.44 73.41,97.2 73.41,66.41 56.04,49.04 51.49,49.04 TEENSY3.2_2.0
TONE  (via drill 0.41)
  Top 0.305: TEENSY3.2_2.RESET/DAC 38.74,81.42 38.05,82.11 33.79,82.11 v33.18,81.5 | v24.18,77.38 24.18,73.42 24.64,72.97 24.64,57.88 29.52,53 29.52,44.62 33.48,40.66 41.86,40.66 45.06,37.46 54.21,37.46 56.34,35.32 56.34,23.13 61.67,17.8 105.72,17.8 v107.24,18.86
  Bottom 0.305: v33.18,81.5 28.3,81.5 v24.18,77.38 | v107.24,18.86 107.24,27.35 BUZZER.+
VUSB
  Top 0.305: USB.VBUS 69.35,34.15 72.95,37.76 USB_2.1

### Text on the board
tPlace: The best way to predict the future is to invent it. | Developed by: / / Alessio Di Brigida / Emanuele Giacomini / Andrea Valeri / Fabio Ricci | PWM 25 G | PWM 20 R | PWM 6 B | 5V | GND | 3.3V | GND | 5V | 3.3V | $$$ | 5V | ° | ON | 3.3V
tNames: 1 | 3 | 5 | 7 | 9 | 11 | 13 | 15 | 17 | 19 | 21 | 23 | 25 | 27 | 29 | Inferiore | Program
Reference: posizione esatta